# Altium project Luna v2.PrjPcb (part 5 of 7)

## Sheet 12 DMIC.SchDoc: Luna v2
size A2; VersionControl_RevNumber: DNP; IsUserConfigurable: DNP; OrgAddr3: Sunrise FL 33323; OrgName: Pixels on Target; Page Create Date: March  8, 1995; Page Number: 5; Page Size: A2; Page Count: 14; OrgAddr2: Suite #104; RevCode: A; Doc: SCH30-00070-00; DsnPath: C:\Users\Carter Nichols\Documents\BitBucket boards (Cadence)\30-00070-00_Original\SCH30-00070-00.DSN; SchematicName: SC30-00070-00; PageName: 05-POWER IN; PageSize: A2; TopSchematic: True; Address4: United States
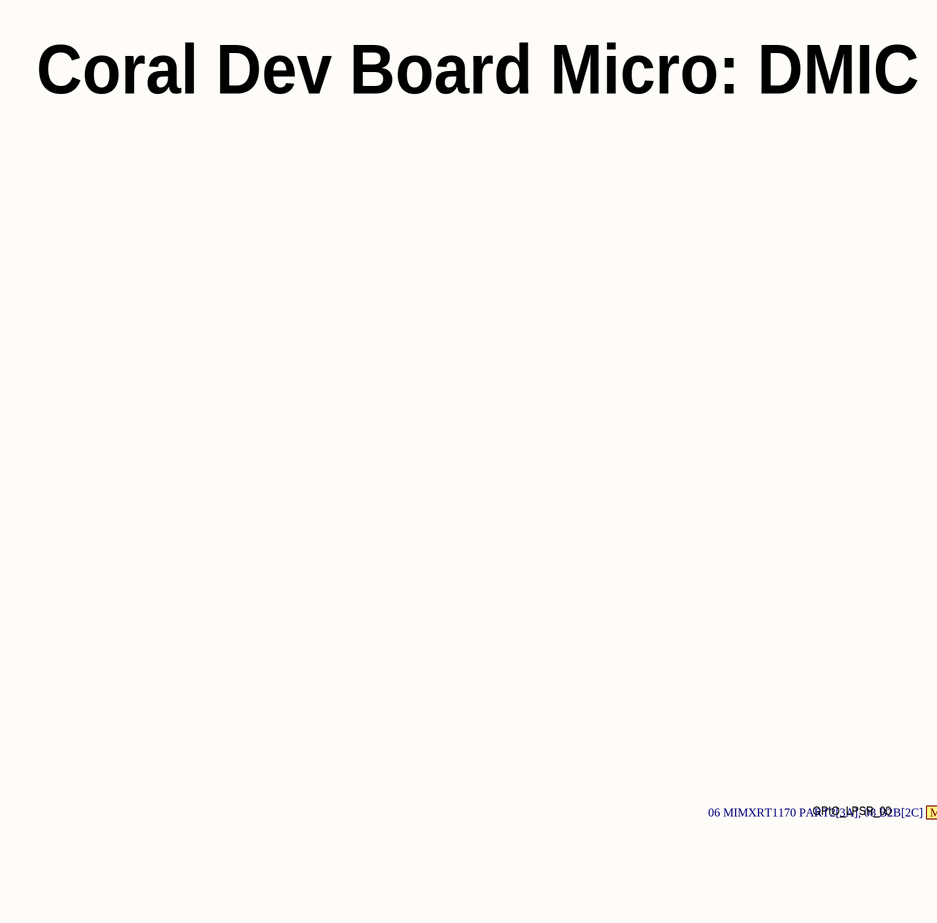
[diagram p17: 12 DMIC.SchDoc, left]
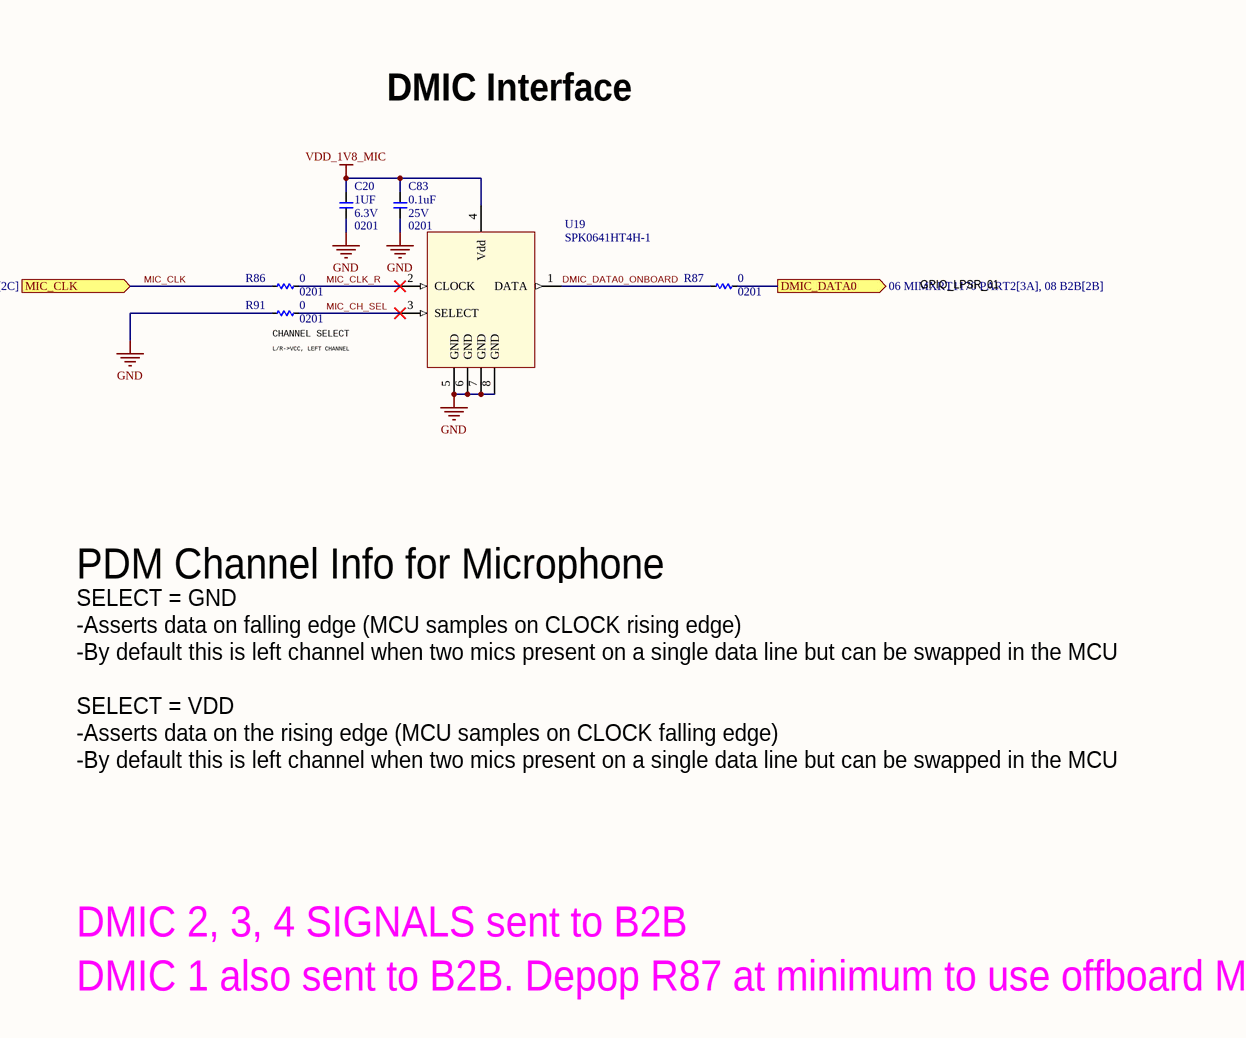
[diagram p18: 12 DMIC.SchDoc, right]

### Parts
C20  value 1UF  Package: 0201  Voltage: 6.3V  [C0201_H0.39MM]  (hidden comment: __Template_Cap)
C83  value 0.1uF  Package: 0201  Voltage: 25V  [C0201Y]  (hidden comment: __Template_Cap)
R86  value 0  Package: 0201  [R0201]
R87  value 0  Package: 0201  [R0201]
R91  value 0  Package: 0201  [R0201]
U19  MFG P/N: SPK0641HT4H-1  [MIC_SPK0641HT4H-1]  (hidden comment: MIC_SPK0641HT4H-1)

### Ports
DMIC_DATA0 (out, see 06 MIMXRT1170 PART2[3A], 08 B2B[2B]), MIC_CLK (in, see 06 MIMXRT1170 PART2[3A], 08 B2B[2C])

### Nets
GND: C20.2 C83.2 R91.1 U19.5(GND) U19.6(GND) U19.7(GND) U19.8(GND)
VDD_1V8_MIC: C20.1 C83.1 U19.4(Vdd)
DMIC_DATA0: R87.2 ; port DMIC_DATA0
DMIC_DATA0_ONBOARD: R87.1 U19.1(DATA)
MIC_CH_SEL: R91.2 U19.3(SELECT)
MIC_CLK: R86.1 ; port MIC_CLK
MIC_CLK_R: R86.2 U19.2(CLOCK)

### Notes on the sheet
- Coral Dev Board Micro: DMIC
- DMIC Interface
- GPIO_LPSR_00
- (near R91) CHANNEL SELECT
- GPIO_LPSR_01
- (near R91) L/R->VCC, LEFT CHANNEL
- PDM Channel Info for Microphone
- SELECT = GND
  -Asserts data on falling edge (MCU samples on CLOCK rising edge)
  -By default this is left channel when two mics present on a single data line but can be swapped in the MCU
  SELECT = VDD
  -Asserts data on the rising edge (MCU samples on CLOCK falling edge)
  -By default this is left channel when two mics present on a single data line but can be swapped in the MCU
- DMIC 2, 3, 4 SIGNALS sent to B2B
- DMIC 1 also sent to B2B. Depop R87 at minimum to use offboard MIC1 left channel.
- Title
- Size:
- Date:
- File:
- A2
- Number:
- Time:
- Revision:
- Sheet
- of

### Library data of the parts
C20 = 1771: CAP, CER, X6S, 1uF, 20%, 6.3V, 0201, 0.39mm; ID: 1771; MFG: MURATA; MFG P/N: GRM033C80J105ME05D; EPIC: G150-02531-00; Status: In Development; Dielectric: X6S; Tolerance: 20%; Height: 0.39mm; Supplier 1: Digi-Key; HelpURL: https://www.digikey.com/product-detail/en/murata-electronics-north-america/GRM033C80J105ME05D/490-13218-1-ND/5877426; ComponentLink1Description: Datasheet; ComponentLink1URL: https://psearch.en.murata.com/capacitor/product/GRM033C80J105ME05%23.pdf; Supplier Part Number 1: 490-13218-1-ND
C83 = 386: CAP, CER, X5R, 0.1uF, 25V, 20%, 0201, 0.33mm T; ID: 386; MFG: MURATA; MFG P/N: GRM033R61E104ME14D; XPN: 150-01204-00; Status: Released; Dielectric: X5R; Tolerance: 20%; Height: 0.33mm T; ComponentLink1Description: Datasheet; COMMON: 150-01204-00; LOON: 150-01204-00; Gecko: 150-01204-00
R86 R87 R91 = 8315: RES, 0.0, 1/20W, 0201; ID: 8315; MFG: PANASONIC; MFG P/N: ERJ1GN0R00C; Tolerance: JUMPER; COMMON: 470-00013-00; PROXY: Use ID #6940; Status: Released; Power: 1/20W; LOON: 470-00013-00; Gecko: 470-00013-00; XPN: 470-00013-00
U19 = 212: AUDIO, MIC, MEMS, OMNIDIRECTIONAL, DIGITAl/PDM O/P, 20Hz TO 20KHz, -26dB SENSITIVITY, +/-1dB, 64.5dB S/N R, SMD; ID: 212; MFG: Knowles; Voltage, Rated: 1.6 V ~ 3.6 V; Status: Released; Category: Microphones; RoHS Compliant: Yes; Supplier 1: Digi-Key; Height: 1.1mm; Mounting Type: SMD; HelpURL: https://www.digikey.com/en/products/detail/knowles/SPK0641HT4H-1/8573345; ComponentLink1Description: Datasheet; ComponentLink1URL: https://www.knowles.com/docs/default-source/model-downloads/spk0641ht4h-1-rev-a.pdf; Supplier Part Number 1: 423-1425-2-ND

## Sheet 13 USB.SchDoc: Luna v2
size A2; VersionControl_RevNumber: DNP; IsUserConfigurable: DNP; OrgAddr3: Sunrise FL 33323; OrgName: Pixels on Target; Page Create Date: March  8, 1995; Page Number: 5; Page Size: A2; Page Count: 14; OrgAddr2: Suite #104; RevCode: A; Doc: SCH30-00070-00; DsnPath: C:\Users\Carter Nichols\Documents\BitBucket boards (Cadence)\30-00070-00_Original\SCH30-00070-00.DSN; SchematicName: SC30-00070-00; PageName: 05-POWER IN; PageSize: A2; TopSchematic: True; Address4: United States
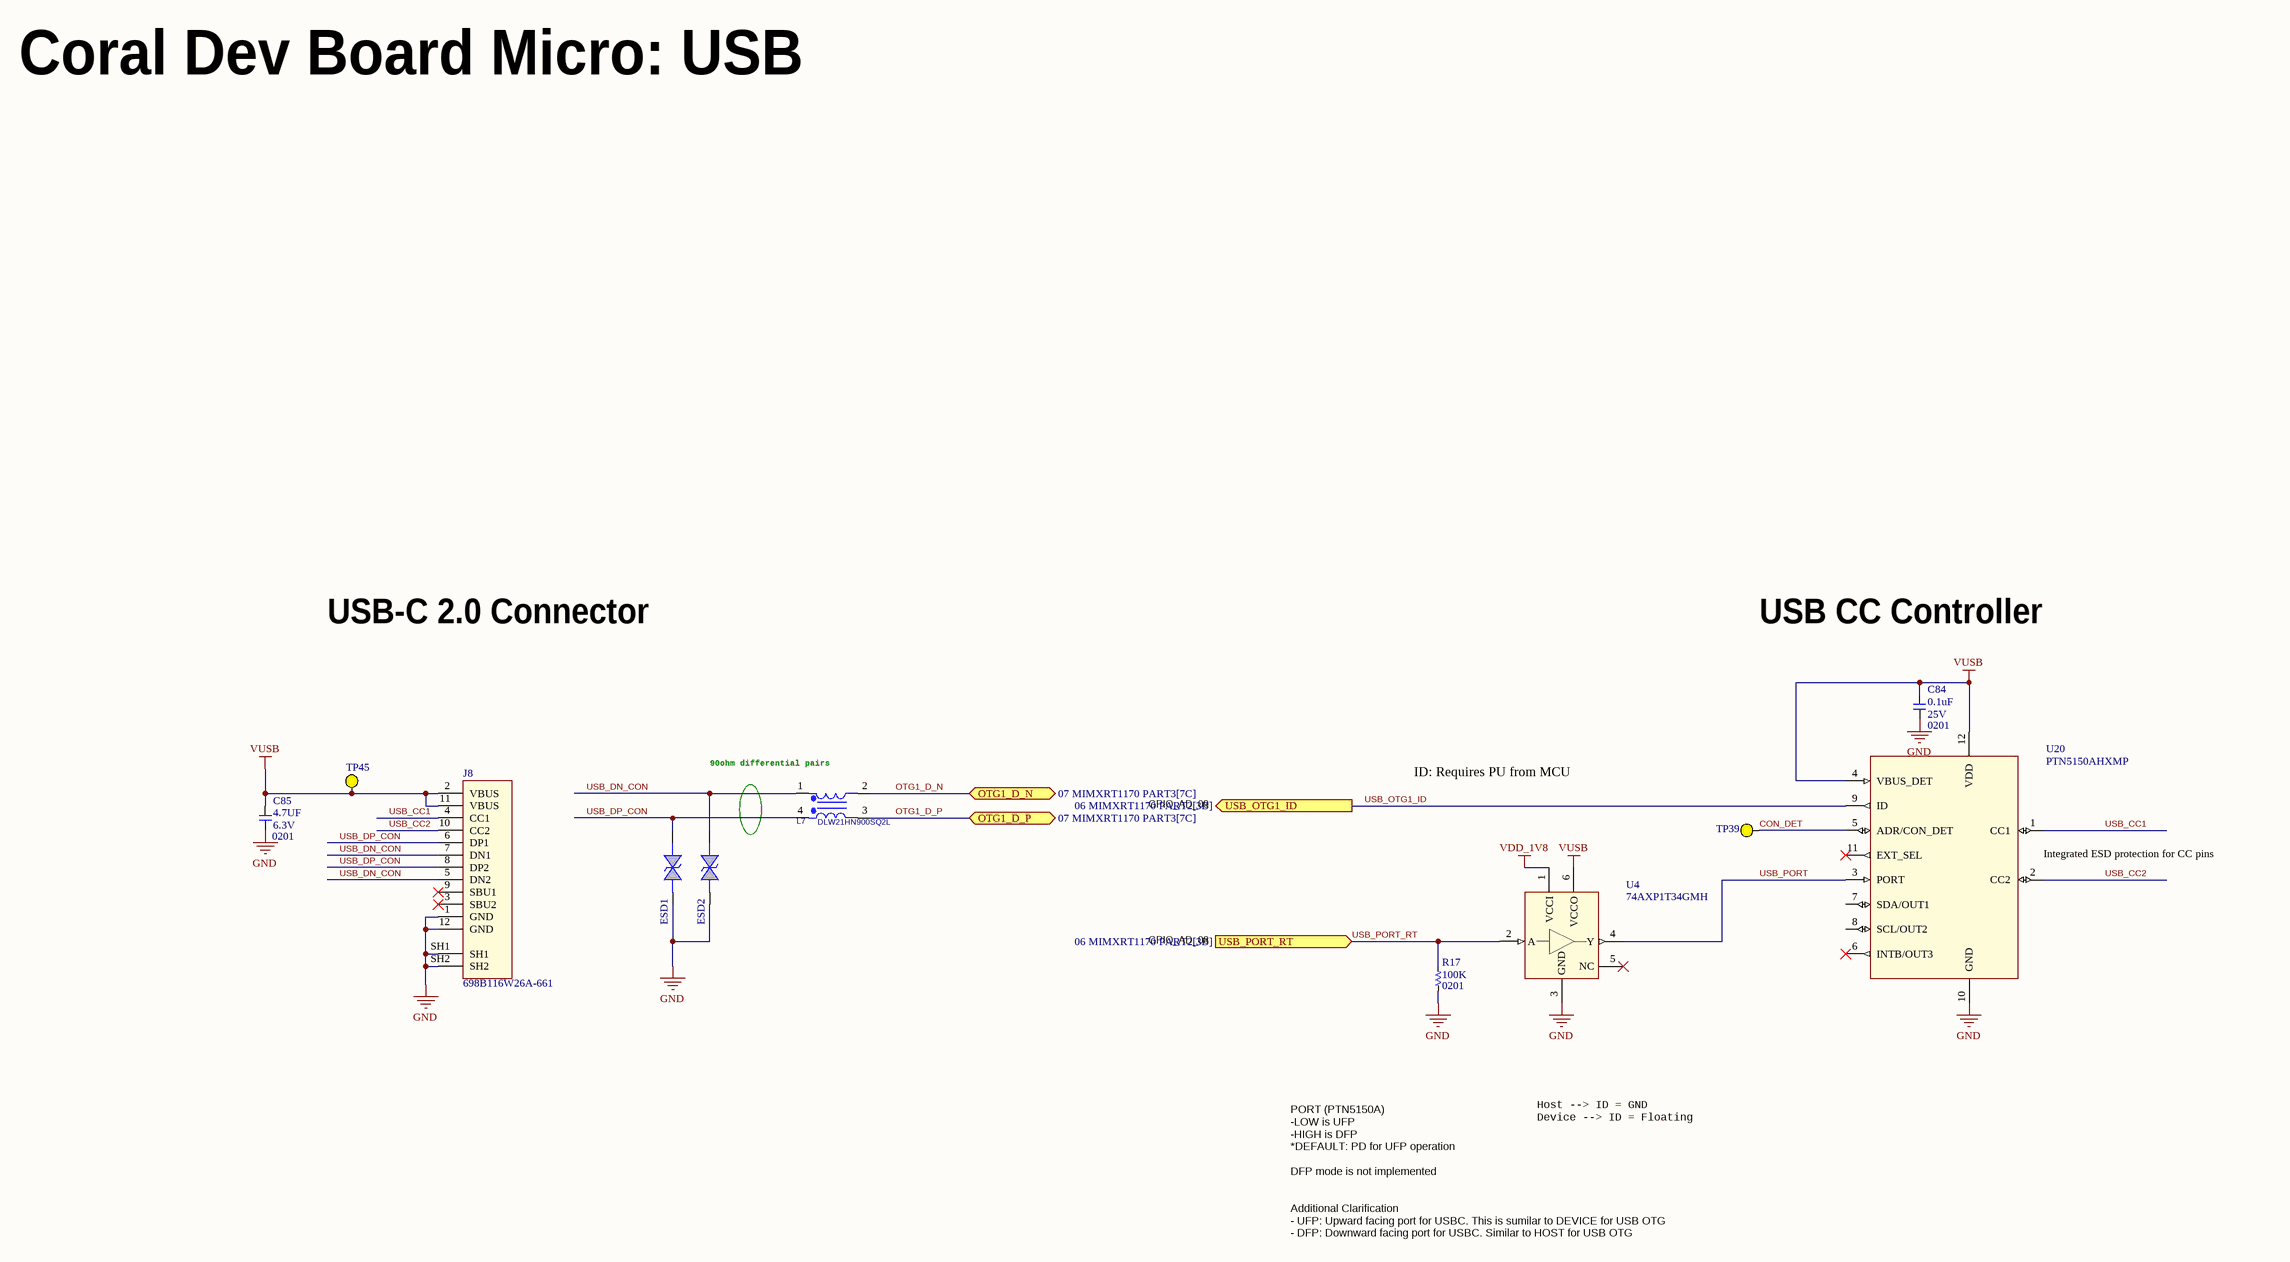
[diagram p19: 13 USB.SchDoc]

### Parts
C84  value 0.1uF  Package: 0201  Voltage: 25V  [C0201Y]  (hidden comment: __Template_Cap)
C85  value 4.7UF  Package: 0201  Voltage: 6.3V  [C0201Y]  (hidden comment: __Template_Cap)
ESD1  3.5pF/5V  [0201]  (value not drawn)
ESD2  3.5pF/5V  [0201]  (value not drawn)
J8  MFG P/N: 698B116W26A-661  [EDAC_698B116W26A-661]
L7  DLW21HN900SQ2L  [IND4_CHOKE_0805]
R17  value 100K  Package: 0201  [R0201]
TP39  TESTPAD_30MIL  [TESTPAD_SMT_30MIL]  (value not drawn)  (no BOM)
TP45  TESTPAD_30MIL  [TESTPAD_SMT_30MIL]  (value not drawn)  (no BOM)
U4  MFG P/N: 74AXP1T34GMH  [SON50P145X100X50-6]  (hidden comment: TRANSLATOR_74AXP1T34GMH)
U20  MFG P/N: PTN5150AHXMP  [X2QFN12_1.6X1.6MMM]  (hidden comment: CONTROLLER_PTN5150AHXMP)

### Ports
OTG1_D_N (bidir, see 07 MIMXRT1170 PART3[7C]), OTG1_D_P (bidir, see 07 MIMXRT1170 PART3[7C]), USB_OTG1_ID (out, see 06 MIMXRT1170 PART2[3B]), USB_PORT_RT (in, see 06 MIMXRT1170 PART2[3B])

### Nets
GND: C84.2 C85.2 ESD1.1 ESD2.1 J8.1(GND) J8.12(GND) J8.SH1 J8.SH2 R17.1 U4.3(GND) U20.10(GND)
VDD_1V8: U4.1(VCCI)
VUSB: C84.1 C85.1 J8.2(VBUS) J8.11(VBUS) TP45.1 U4.6(VCCO) U20.4(VBUS_DET) U20.12(VDD)
CON_DET: TP39.1 U20.5(ADR/CON_DET)
OTG1_D_N: L7.2 ; port OTG1_D_N
OTG1_D_P: L7.3 ; port OTG1_D_P
USB_CC1: J8.4(CC1) U20.1(CC1)
USB_CC2: J8.10(CC2) U20.2(CC2)
USB_DN_CON: ESD2.2 J8.5(DN2) J8.7(DN1) L7.1
USB_DP_CON: ESD1.2 J8.6(DP1) J8.8(DP2) L7.4
USB_OTG1_ID: U20.9(ID) ; port USB_OTG1_ID
USB_PORT: U4.4(Y) U20.3(PORT)
USB_PORT_RT: R17.2 U4.2(A) ; port USB_PORT_RT

Not connected (* = marked no-connect by the designer): J8 3(SBU2)* 9(SBU1)*; U4 5(NC)*; U20 6(INTB/OUT3)* 7(SDA/OUT1) 8(SCL/OUT2) 11(EXT_SEL)*

### Notes on the sheet
- Coral Dev Board Micro: USB
- USB-C 2.0 Connector
- USB CC Controller
- (near L7) 90ohm differential pairs
- ID: Requires PU from MCU
- GPIO_AD_09
- (near U20) Integrated ESD protection for CC pins
- GPIO_AD_08
- Host --> ID = GND
  Device --> ID = Floating
- PORT (PTN5150A)
  -LOW is UFP
  -HIGH is DFP
  *DEFAULT: PD for UFP operation
  DFP mode is not implemented
- Additional Clarification
  - UFP: Upward facing port for USBC. This is sumilar to DEVICE for USB OTG
  - DFP: Downward facing port for USBC. Similar to HOST for USB OTG
- Title
- Size:
- Date:
- File:
- A2
- Number:
- Time:
- Revision:
- Sheet
- of

### Library data of the parts
C84 = 386: as C83 on sheet 12 DMIC; Status: Released; Dielectric: X5R; Tolerance: 20%; Height: 0.33mm T; ComponentLink1Description: Datasheet; COMMON: 150-01204-00; LOON: 150-01204-00; Gecko: 150-01204-00
C85 = 1199: CAP, CER, X5R, 4.7uF, 20%, 6.3V, 0201; ID: 1199; MFG: MURATA; MFG P/N: GRM035R60J475ME15D; XPN: 150-01224-00; PROXY: 150-03477-00; Status: Released; Dielectric: X5R; Tolerance: 20%; Height: 0.33mm T; ComponentLink1Description: Datasheet; COMMON: 150-01224-00; LOON: 150-01224-00; Gecko: 150-01224-00
ESD1 ESD2 = DIODE BI-DIR TRIG: DIODE TVS 15kV 10V 50A 8pF SMT RoHS; MPN: DESD5V0V1BCSP-7; QPN: BC5V0V1BZ02; QPN Description: DIODE ESD SMD DESD5V0V1BCSP-7 6V,DSN0603; Function Code: USB; QCI MPN: DESD5V0V1BCSP-7; QCI Supplier: DDS
J8 = 1283: CONN, USB-C, RCPT, RA, USB 2.0, 16 P, 0.5MM PITCH, GOLD, SMT; ID: 1283; MFG: EDAC Inc; Number of Positions: 12; Current Rating: 3A; Voltage, Rated: 100VAC; Sub Assy Qty 2: 0; Status: Released; RoHS Compliant: Yes; Mounting Type: Surface Mount; Orientation: Right Angle; Number of Rows: 1; Operating Temperature: -30°C ~ 85°C; ComponentLink1Description: Datasheet; ComponentLink1URL: https://drive.google.com/corp/drive/folders/1cT-VNuTRhR0OJylJtjEkdbP9sP_ssI5q; Height: 2.71mm; Sub Assy Qty 3: 0; Sub Assy Qty 4: 0
L7 = IND_CMC_DLW21: IND CHK 90 OHM@100MHZ 330MA 25% 0805; QPN: CX1HN900000; QPN Description: EMI FILTER DLW21HN900SQ2L(90,330MA); Function Code: DBG; Supplier 1: Digi-Key; Supplier Part Number 1: 490-1064-1-ND; MPN: DLW21HN900SQ2L; QCI MPN: DLW21HN900SQ2L; QCI Supplier: MUR
R17 = 7818: RES, 100K, 1%, 1/20W, 0201; ID: 7818; MFG: PANASONIC; MFG P/N: ERJ1GEF1003C; COMMON: 470-00506-00; Status: NRND; Power: 1/20W; Tolerance: 1%; LOON: 470-00506-00; Gecko: 470-00506-00; XPN: 470-00506-00
TP39 TP45 = 178: TESTPAD_SMT_30MIL; ID: 178; MFG: _PCB Feature; Status: Released; ComponentLink1URL: _PCB Feature
U4 = 441: IC, TRANSLATOR, 74AXP1, UNIDIR, 1-CH, NON-INVERTED O/P, LOW NOISE OVERSHOOT, XSON-6; ID: 441; MFG: Nexperia USA Inc.; Status: Released; Package: 6-XSON, SOT886 (1.45x1); Category: Integrated Circuits (ICs); RoHS Compliant: Yes; Supplier 1: Digi-Key; ComponentLink1Description: Datasheet; ComponentLink1URL: https://assets.nexperia.com/documents/data-sheet/74AXP1T34.pdf; Mounting Type: SMD; Height: 0.5mm; Supplier Part Number 1: 1727-2482-2-ND; HelpURL: https://www.digikey.com/en/products/detail/nexperia-usa-inc/74AXP1T34GMH/5971133?s=N4IgTCBcDaIOwBYCCANACgRgCoGYEHEBZACRAF0BfIA
U20 = 224: IC, HOST CTLR, PTN5150A, USB, 2.7 TO 5.5 VIN, X2QFN-12; ID: 224; MFG: NXP USA Inc.; Status: Released; Package: 12-X2QFN (1.6x1.6); RoHS Compliant: YES; Supplier 1: Digi-Key; HelpURL: https://www.digikey.in/product-detail/en/nxp-usa-inc/PTN5150AHXMP/568-13083-1-ND/6569882; ComponentLink1Description: Datasheet; ComponentLink1URL: https://www.nxp.com/docs/en/data-sheet/PTN5150A.pdf; Mounting Type: SMD; Supplier Part Number 1: 568-13083-1-ND

## Sheet 14 TPU.SchDoc: Luna v2
size A2; VersionControl_RevNumber: DNP; IsUserConfigurable: DNP; OrgAddr3: Sunrise FL 33323; OrgName: Pixels on Target; Page Create Date: March  8, 1995; Page Number: 5; Page Size: A2; Page Count: 14; OrgAddr2: Suite #104; RevCode: A; Doc: SCH30-00070-00; DsnPath: C:\Users\Carter Nichols\Documents\BitBucket boards (Cadence)\30-00070-00_Original\SCH30-00070-00.DSN; SchematicName: SC30-00070-00; PageName: 05-POWER IN; PageSize: A2; TopSchematic: True; Address4: United States
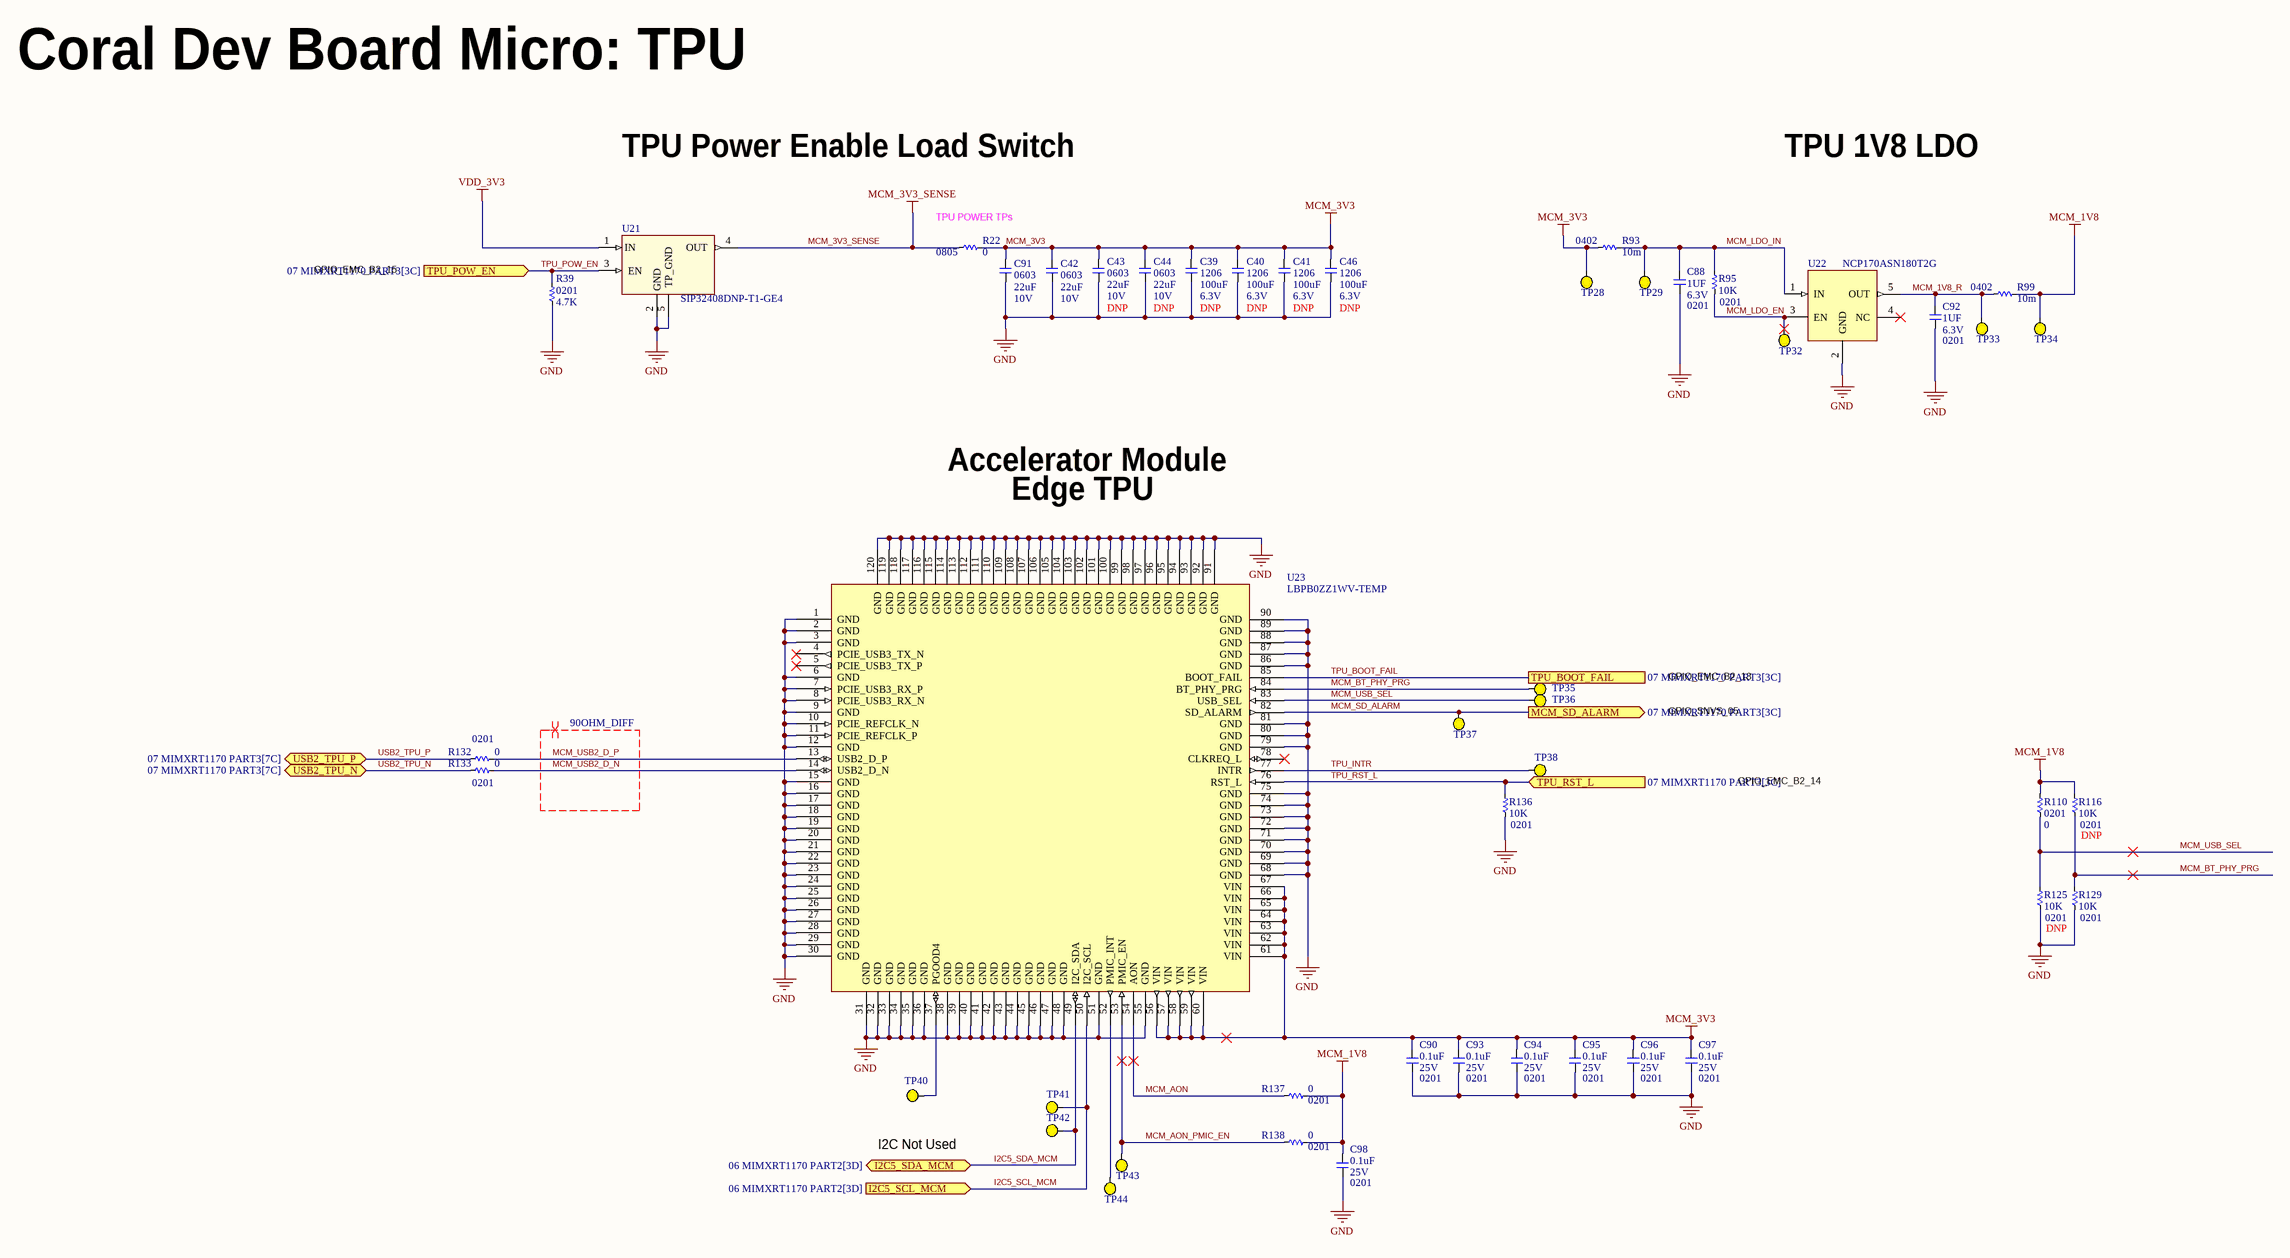
[diagram p20: 14 TPU.SchDoc]

### Parts
C39  value 100uF  Package: 1206  Voltage: 6.3V  [C1206Y_1.90MM]  (hidden comment: __Template_Cap)
C40  value 100uF  Package: 1206  Voltage: 6.3V  [C1206Y_1.90MM]  (hidden comment: __Template_Cap)
C41  value 100uF  Package: 1206  Voltage: 6.3V  [C1206Y_1.90MM]  (hidden comment: __Template_Cap)
C42  value 22uF  Package: 0603  Voltage: 10V  [C0603]  (hidden comment: __Template_Cap)
C43  value 22uF  Package: 0603  Voltage: 10V  [C0603]  (hidden comment: __Template_Cap)
C44  value 22uF  Package: 0603  Voltage: 10V  [C0603]  (hidden comment: __Template_Cap)
C46  value 100uF  Package: 1206  Voltage: 6.3V  [C1206Y_1.90MM]  (hidden comment: __Template_Cap)
C88  value 1UF  Package: 0201  Voltage: 6.3V  [C0201_H0.39MM]  (hidden comment: __Template_Cap)
C90  value 0.1uF  Package: 0201  Voltage: 25V  [C0201Y]  (hidden comment: __Template_Cap)
C91  value 22uF  Package: 0603  Voltage: 10V  [C0603]  (hidden comment: __Template_Cap)
C92  value 1UF  Package: 0201  Voltage: 6.3V  [C0201_H0.39MM]  (hidden comment: __Template_Cap)
C93  value 0.1uF  Package: 0201  Voltage: 25V  [C0201Y]  (hidden comment: __Template_Cap)
C94  value 0.1uF  Package: 0201  Voltage: 25V  [C0201Y]  (hidden comment: __Template_Cap)
C95  value 0.1uF  Package: 0201  Voltage: 25V  [C0201Y]  (hidden comment: __Template_Cap)
C96  value 0.1uF  Package: 0201  Voltage: 25V  [C0201Y]  (hidden comment: __Template_Cap)
C97  value 0.1uF  Package: 0201  Voltage: 25V  [C0201Y]  (hidden comment: __Template_Cap)
C98  value 0.1uF  Package: 0201  Voltage: 25V  [C0201Y]  (hidden comment: __Template_Cap)
R22  value 0  Package: 0805  [R0805]
R39  value 4.7K  Package: 0201  [R0201]
R93  value 10m  Package: 0402  [R0402]
R95  value 10K  Package: 0201  [R0201]
R99  value 10m  Package: 0402  [R0402]
R110  value 0  Package: 0201  [R0201]
R116  value 10K  Package: 0201  [R0201]
R125  value 10K  Package: 0201  [R0201]
R129  value 10K  Package: 0201  [R0201]
R132  value 0  Package: 0201  [R0201]
R133  value 0  Package: 0201  [R0201]
R136  value 10K  Package: 0201  [R0201]
R137  value 0  Package: 0201  [R0201]
R138  value 0  Package: 0201  [R0201]
TP28  TESTPAD_25MIL  [TESTPAD_SMT_25MIL]  (value not drawn)  (no BOM)
TP29  TESTPAD_25MIL  [TESTPAD_SMT_25MIL]  (value not drawn)  (no BOM)
TP32  TESTPAD_25MIL  [TESTPAD_SMT_25MIL]  (value not drawn)  (no BOM)
TP33  TESTPAD_25MIL  [TESTPAD_SMT_25MIL]  (value not drawn)  (no BOM)
TP34  TESTPAD_25MIL  [TESTPAD_SMT_25MIL]  (value not drawn)  (no BOM)
TP35  TESTPAD_25MIL  [TESTPAD_SMT_25MIL]  (value not drawn)  (no BOM)
TP36  TESTPAD_25MIL  [TESTPAD_SMT_25MIL]  (value not drawn)  (no BOM)
TP37  TESTPAD_25MIL  [TESTPAD_SMT_25MIL]  (value not drawn)  (no BOM)
TP38  TESTPAD_25MIL  [TESTPAD_SMT_25MIL]  (value not drawn)  (no BOM)
TP40  TESTPAD_25MIL  [TESTPAD_SMT_25MIL]  (value not drawn)  (no BOM)
TP41  TESTPAD_25MIL  [TESTPAD_SMT_25MIL]  (value not drawn)  (no BOM)
TP42  TESTPAD_25MIL  [TESTPAD_SMT_25MIL]  (value not drawn)  (no BOM)
TP43  TESTPAD_25MIL  [TESTPAD_SMT_25MIL]  (value not drawn)  (no BOM)
TP44  TESTPAD_25MIL  [TESTPAD_SMT_25MIL]  (value not drawn)  (no BOM)
U21  MFG P/N: SIP32408DNP-T1-GE4  [TDFN120X160X60-4-TP]  (hidden comment: SWITCH_SIP32408DNP-T1-GE4)
U22  MFG P/N: NCP170ASN180T2G  [TSOP95P275X110-5]  (hidden comment: LDO_NCP170ASN180T2G)
U23  LBPB0ZZ1WV-TEMP  [QFN120_0P5_10X15]

### Ports
I2C5_SCL_MCM (in, see 06 MIMXRT1170 PART2[3D]), I2C5_SDA_MCM (bidir, see 06 MIMXRT1170 PART2[3D]), MCM_SD_ALARM (out, see 07 MIMXRT1170 PART3[3C]), TPU_BOOT_FAIL (see 07 MIMXRT1170 PART3[3C]), TPU_POW_EN (in, see 07 MIMXRT1170 PART3[3C]), TPU_RST_L (in, see 07 MIMXRT1170 PART3[3C]), USB2_TPU_N (bidir, see 07 MIMXRT1170 PART3[7C]), USB2_TPU_P (bidir, see 07 MIMXRT1170 PART3[7C])

### Nets
GND: C39.2 C40.2 C41.2 C42.2 C43.2 C44.2 C46.2 C88.2 C90.2 C91.2 C92.2 C93.2 C94.2 C95.2 C96.2 C97.2 C98.2 R39.1 R125.1 R129.1 R136.1 U21.2(GND) U21.5(TP_GND) U22.2(GND) U23.1(GND) U23.2(GND) U23.3(GND) U23.6(GND) U23.7(PCIE_USB3_RX_P) U23.8(PCIE_USB3_RX_N) U23.9(GND) U23.10(PCIE_REFCLK_N) U23.11(PCIE_REFCLK_P) U23.12(GND) U23.15(GND) U23.16(GND) U23.17(GND) U23.18(GND) U23.19(GND) U23.20(GND) U23.21(GND) U23.22(GND) U23.23(GND) U23.24(GND) U23.25(GND) U23.26(GND) U23.27(GND) U23.28(GND) U23.29(GND) U23.30(GND) U23.31(GND) U23.32(GND) U23.33(GND) U23.34(GND) U23.35(GND) U23.36(GND) U23.38(GND) U23.39(GND) U23.40(GND) U23.41(GND) U23.42(GND) U23.43(GND) U23.44(GND) U23.45(GND) U23.46(GND) U23.47(GND) U23.48(GND) U23.51(GND) U23.55(GND) U23.68(GND) U23.69(GND) U23.70(GND) U23.71(GND) U23.72(GND) U23.73(GND) U23.74(GND) U23.75(GND) U23.79(GND) U23.80(GND) U23.81(GND) U23.86(GND) U23.87(GND) U23.88(GND) U23.89(GND) U23.90(GND) U23.91(GND) U23.92(GND) U23.93(GND) U23.94(GND) U23.95(GND) U23.96(GND) U23.97(GND) U23.98(GND) U23.99(GND) U23.100(GND) U23.101(GND) U23.102(GND) U23.103(GND) U23.104(GND) U23.105(GND) U23.106(GND) U23.107(GND) U23.108(GND) U23.109(GND) U23.110(GND) U23.111(GND) U23.112(GND) U23.113(GND) U23.114(GND) U23.115(GND) U23.116(GND) U23.117(GND) U23.118(GND) U23.119(GND) U23.120(GND)
MCM_1V8: C98.1 R99.2 R110.2 R116.2 R137.2 R138.2 TP34.1
MCM_3V3: C39.1 C40.1 C41.1 C42.1 C43.1 C44.1 C46.1 C90.1 C91.1 C93.1 C94.1 C95.1 C96.1 C97.1 R22.2 R93.1 TP28.1 U23.56(VIN) U23.57(VIN) U23.58(VIN) U23.59(VIN) U23.60(VIN) U23.61(VIN) U23.62(VIN) U23.63(VIN) U23.64(VIN) U23.65(VIN) U23.66(VIN) U23.67(VIN)
MCM_3V3_SENSE: R22.1 U21.4(OUT)
VDD_3V3: U21.1(IN)
I2C5_SCL_MCM: TP41.1 U23.50(I2C_SCL) ; port I2C5_SCL_MCM
I2C5_SDA_MCM: TP42.1 U23.49(I2C_SDA) ; port I2C5_SDA_MCM
MCM_1V8_R: C92.1 R99.1 TP33.1 U22.5(OUT)
MCM_AON: R137.1 U23.54(AON)
MCM_AON_PMIC_EN: R138.1 TP43.1 U23.53(PMIC_EN)
MCM_BT_PHY_PRG: R116.1 R129.2 TP35.1 U23.84(BT_PHY_PRG)
MCM_LDO_EN: R95.1 TP32.1 U22.3(EN)
MCM_LDO_IN: C88.1 R93.2 R95.2 TP29.1 U22.1(IN)
MCM_SD_ALARM: TP37.1 U23.82(SD_ALARM) ; port MCM_SD_ALARM
MCM_USB2_D_N: R133.2 U23.14(USB2_D_N)
MCM_USB2_D_P: R132.2 U23.13(USB2_D_P)
MCM_USB_SEL: R110.1 R125.2 TP36.1 U23.83(USB_SEL)
TPU_BOOT_FAIL: U23.85(BOOT_FAIL) ; port TPU_BOOT_FAIL
TPU_INTR: TP38.1 U23.77(INTR)
TPU_POW_EN: R39.2 U21.3(EN) ; port TPU_POW_EN
TPU_RST_L: R136.2 U23.76(RST_L) ; port TPU_RST_L
USB2_TPU_N: R133.1 ; port USB2_TPU_N
USB2_TPU_P: R132.1 ; port USB2_TPU_P
NetTP40_1: TP40.1 U23.37(PGOOD4)
NetTP44_1: TP44.1 U23.52(PMIC_INT)

Not connected (* = marked no-connect by the designer): U22 4(NC)*; U23 4(PCIE_USB3_TX_N)* 5(PCIE_USB3_TX_P)* 78(CLKREQ_L)*

### Layout directives
differential pair; differential pair class 90OHM_DIFF: MCM_USB2_D_N, MCM_USB2_D_P

### Notes on the sheet
- Coral Dev Board Micro: TPU
- TPU Power Enable Load Switch
- TPU 1V8 LDO
- GPIO_EMC_B2_15
- (near R22) TPU POWER TPs
- Accelerator Module
- Edge TPU
- GPIO_EMC_B2_13
- GPIO_SNVS_05
- GPIO_EMC_B2_14
- (near TP40) I2C Not Used
- Title
- Size:
- Date:
- File:
- A2
- Number:
- Time:
- Revision:
- Sheet
- of

### Library data of the parts
C39-C41 C46 = 1051: CAP, CER, X5R, 100UF, 6.3V, 20%, 1206; ID: 1051; MFG: MURATA; MFG P/N: GRM31CR60J107ME39L; XPN: 150-00520-00; PROXY: 150-04679-00; Status: Obsolete; Dielectric: X5R; Tolerance: 20%; Height: 1.9mm T; ComponentLink1Description: Datasheet; COMMON: 150-00520-00; DNP: DNP
C42 C91 = 108: CAP, CER, X5R, 22uF, 20%, 10V, 0603; ID: 108; MFG: TDK; MFG P/N: C1608X5R1A226M080AC; XPN: 150-00202-00; PROXY: Use ID #452; Status: Released; Dielectric: X5R; Tolerance: 20%; Height: 1mm; ComponentLink1Description: Datasheet; COMMON: 150-00202-00
C43 C44 = 392: CAP, CER, X5R, 22uF, 20%, 10V, 0603; ID: 392; MFG: SAMSUNG; MFG P/N: CL10A226MP8NUNE; XPN: 150-00202-00; PROXY: Use ID #452; Status: Released; Dielectric: X5R; Tolerance: 20%; Height: 0.9mm T; ComponentLink1Description: Datasheet; COMMON: 150-00202-00; DNP: DNP
C88 C92 = 1771: as C20 on sheet 12 DMIC; Status: In Development; Dielectric: X6S; Tolerance: 20%; Height: 0.39mm; Supplier 1: Digi-Key; HelpURL: https://www.digikey.com/product-detail/en/murata-electronics-north-america/GRM033C80J105ME05D/490-13218-1-ND/5877426; ComponentLink1Description: Datasheet; ComponentLink1URL: https://psearch.en.murata.com/capacitor/product/GRM033C80J105ME05%23.pdf; Supplier Part Number 1: 490-13218-1-ND
C90 C93-C98 = 386: as C83 on sheet 12 DMIC; Status: Released; Dielectric: X5R; Tolerance: 20%; Height: 0.33mm T; ComponentLink1Description: Datasheet; COMMON: 150-01204-00; LOON: 150-01204-00; Gecko: 150-01204-00
R22 = 7564: RES, 0, JUMPER, 1/8W, 0805; ID: 7564; MFG: YAGEO; MFG P/N: RC0805JR-070RL; Tolerance: 5%; COMMON: 470-00435-00; Gecko: 470-17928-00; Status: Released; Power: 1/8W; LOON: 470-00435-00; XPN: 470-00435-00
R39 = 6602: RES, 4.7K, 5%, 1/20W, 0201; ID: 6602; MFG: YAGEO; MFG P/N: RC0201JR-074K7L; COMMON: 470-00012-00; Status: Released; Power: 1/20W; Tolerance: 5%; LOON: 470-00012-00; Gecko: 470-00012-00; XPN: 470-00012-00
R93 R99 = 7159: RES, 0.01, 5%, 1/4W, 0402; ID: 7159; MFG: YAGEO; MFG P/N: PE0402JRF470R01L; COMMON: 470-02385-00; Status: Released; Power: 1/4W; Tolerance: 5%; LOON: 470-02385-00; Gecko: 470-02385-00; XPN: 470-02385-00
R95 R116 R125 R129 R136 = 4151: RES, 10K, 1%, 1/20W, 0201; ID: 4151; MFG: YAGEO; MFG P/N: RC0201FR-0710KL; COMMON: 470-00033-00; PROXY: 470-16076-00; Status: Released; Power: 1/20W; Tolerance: 1%; Height: 0.26mm; Supplier 1: Digi-Key; LOON: 470-00033-00; Gecko: 470-00033-00; XPN: 470-00033-00; Supplier Part Number 1: 311-10.0KMCT-ND
  R116 R125: DNP: DNP
R110 R132 R133 R137 R138 = 8315: as R86 on sheet 12 DMIC; Status: Released; Power: 1/20W; LOON: 470-00013-00; Gecko: 470-00013-00; XPN: 470-00013-00
TP28 TP29 TP32-TP38 TP40-TP44 = 115: TESTPAD_SMT_25MIL; ID: 115; MFG: _PCB Feature; Status: In Development; ComponentLink1URL: _PCB Feature
U21 = 926: IC, SW, SIP32408, HIGH-SIDE, N-CH, 1:1, 1.1V TO 5.5V VCL, 3.5A, 44mOHM RDS(ON), TDFN-4; ID: 926; MFG: Vishay Siliconix; Status: Released; Package: 4-TDFN (1.2x1.6); Category: Integrated Circuits (ICs); RoHS Compliant: Yes; Supplier 1: Digi-Key; HelpURL: https://www.digikey.com/en/products/detail/vishay-siliconix/SIP32408DNP-T1-GE4/4496331?s=N4IgTCBcDaIAQGUCSAFAzGALABgBwBEA5FAWgBUBGEgcQFFMQBdAXyA; ComponentLink1Description: Datasheet; ComponentLink1URL: https://www.vishay.com/docs/63717/sip32408.pdf; Mounting Type: SMD; Height: 0.6mm; Supplier Part Number 1: SIP32408DNP-T1-GE4TR-ND
U22 = 930: IC, REG, NCP170AS, LINEAR, FIXED, 2.2V TO 5.5V VIN, 1.8V VOUT, 150mA, TSOP-5; ID: 930; MFG: onsemi; Status: Released; Package: 5-TSOP; Category: Integrated Circuits (ICs); RoHS Compliant: Yes; Supplier 1: Digi-Key; HelpURL: https://www.digikey.com/en/products/detail/onsemi/NCP170ASN180T2G/9829222?s=N4IgTCBcDaIHIGEAKBGA7ABgIIGU4oA4MAVMAcRAF0BfIA; ComponentLink1Description: Datasheet; ComponentLink1URL: https://www.onsemi.com/pdf/datasheet/ncp170-d.pdf; Mounting Type: SMD; Height: 1.1mm; Supplier Part Number 1: NCP170ASN180T2GOSTR-ND
U23 = LBPB0ZZ1WV-TEMP: TPU module

## Sheet 15 BOOT.SchDoc: Luna v2
size A2; VersionControl_RevNumber: DNP; IsUserConfigurable: DNP; OrgAddr3: Sunrise FL 33323; OrgName: Pixels on Target; Page Create Date: March  8, 1995; Page Number: 5; Page Size: A2; Page Count: 14; OrgAddr2: Suite #104; RevCode: A; Doc: SCH30-00070-00; DsnPath: C:\Users\Carter Nichols\Documents\BitBucket boards (Cadence)\30-00070-00_Original\SCH30-00070-00.DSN; SchematicName: SC30-00070-00; PageName: 05-POWER IN; PageSize: A2; TopSchematic: True; Address4: United States
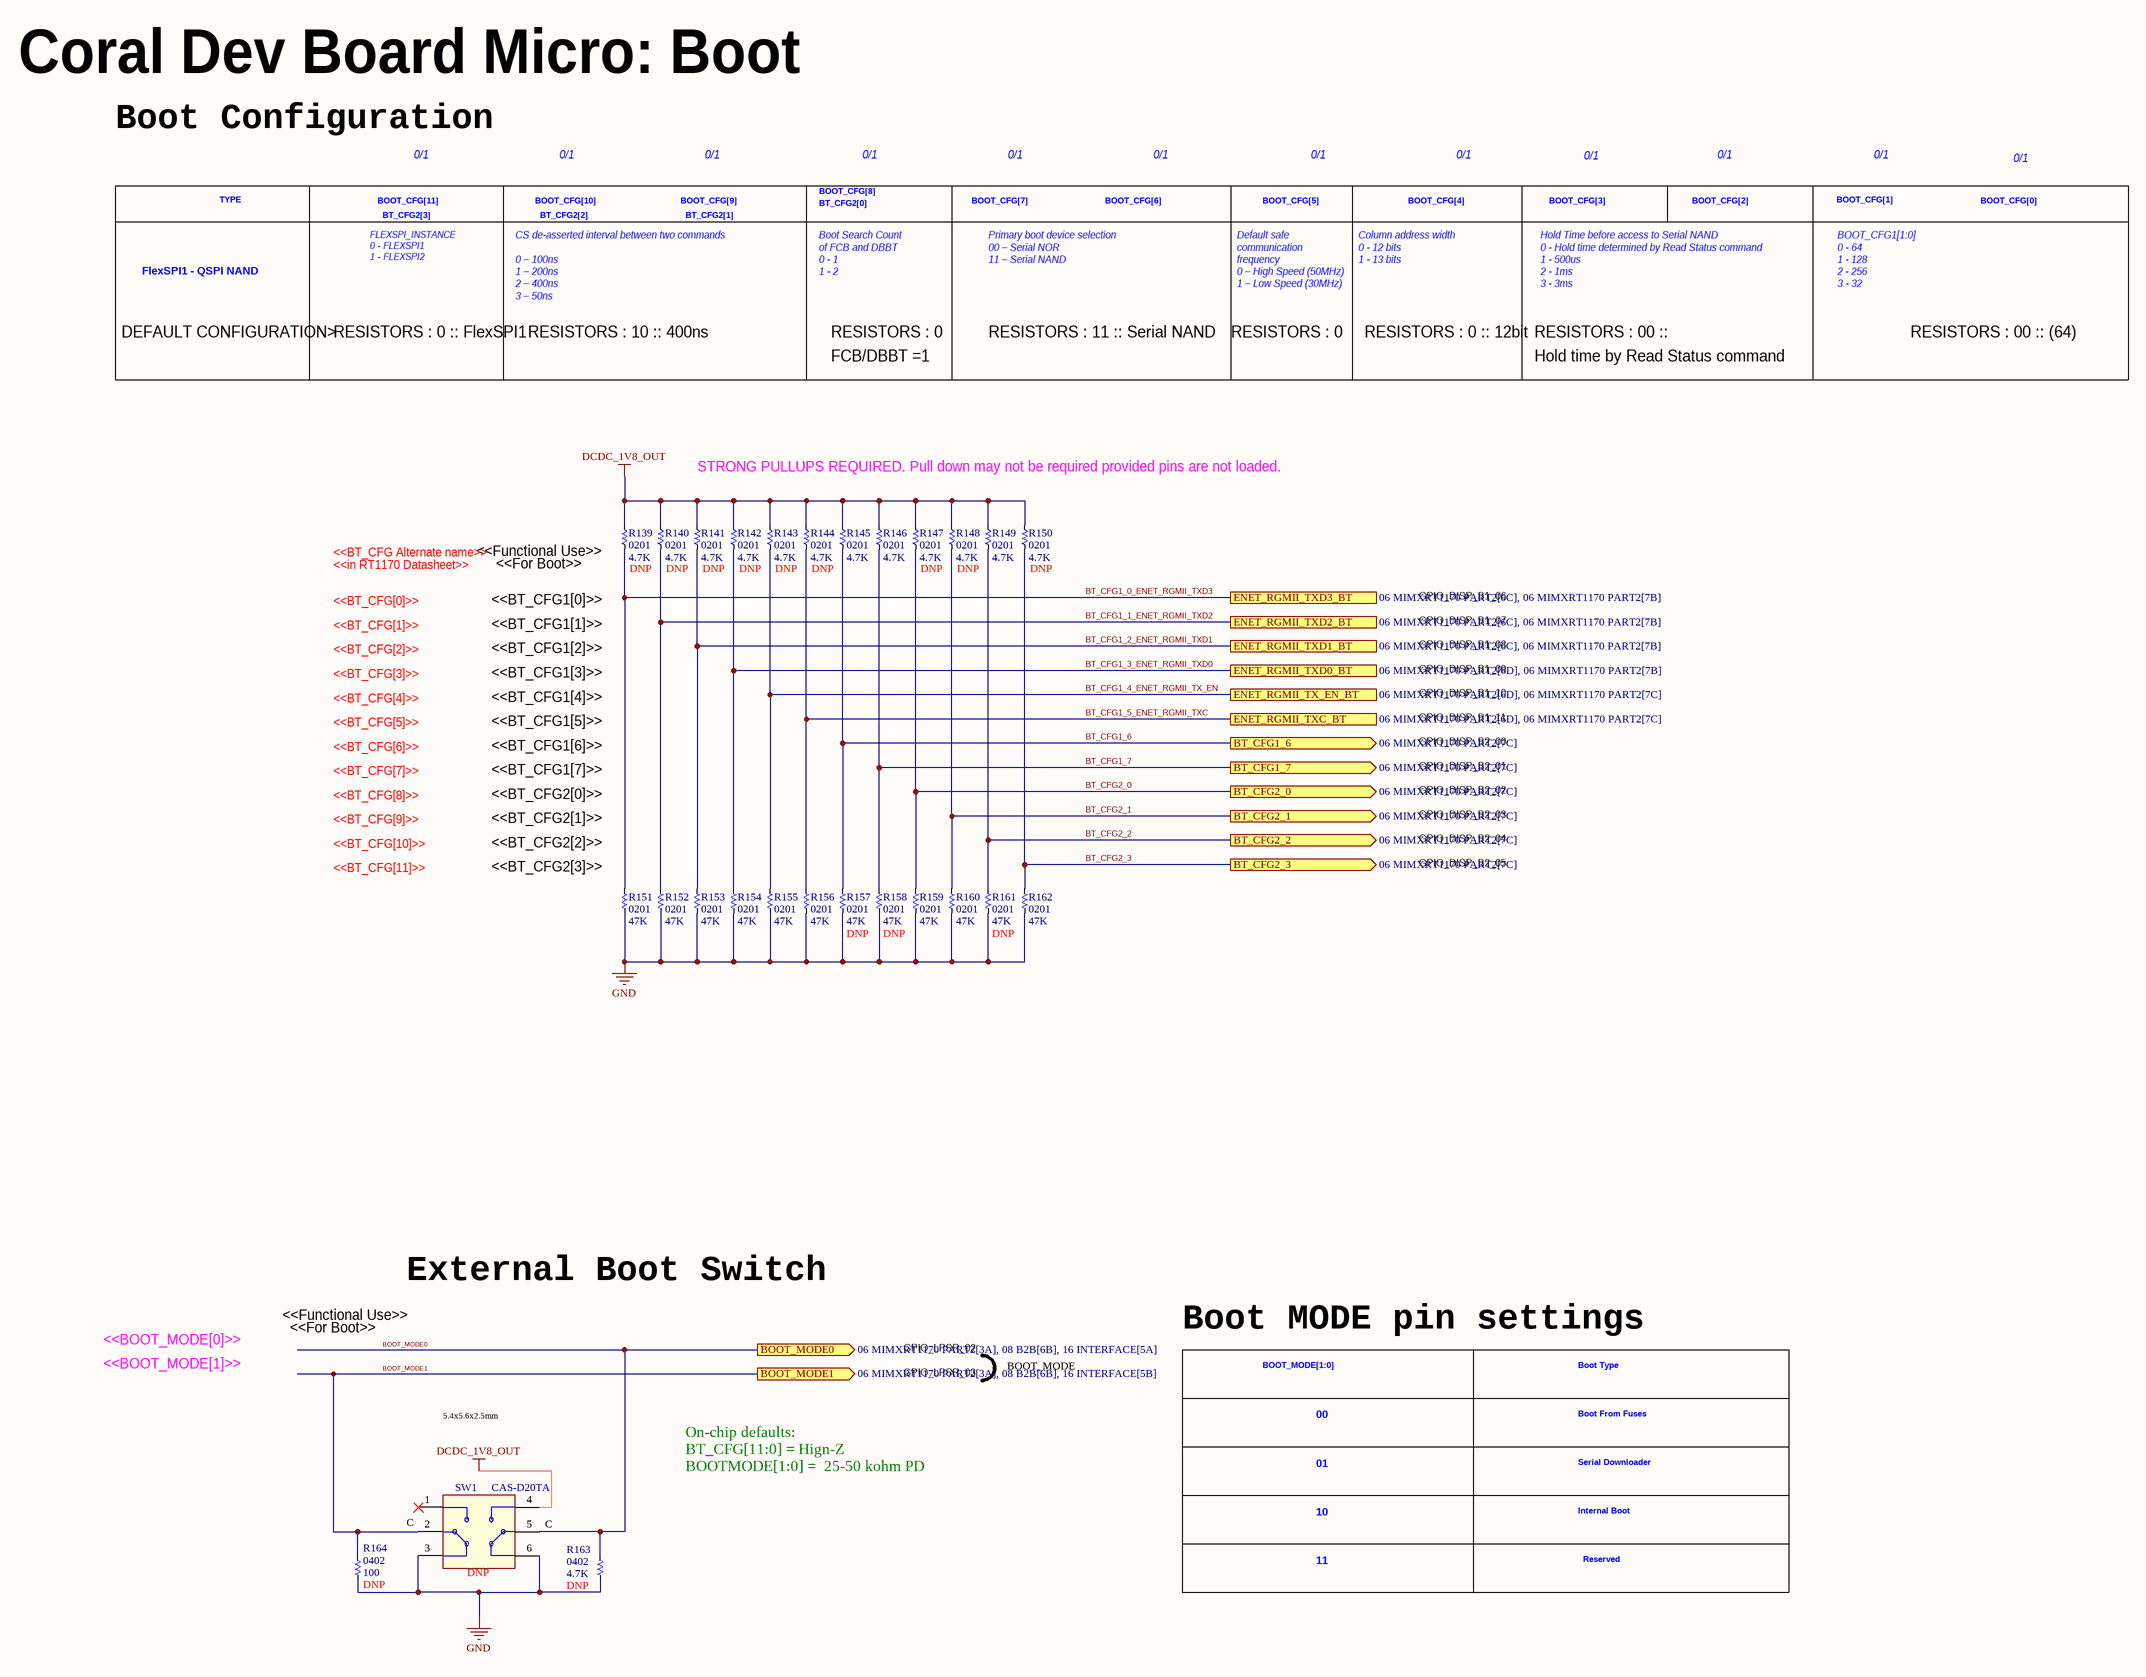
[diagram p21: 15 BOOT.SchDoc]

### Parts
R139  value 4.7K  Package: 0201  [R0201]
R140  value 4.7K  Package: 0201  [R0201]
R141  value 4.7K  Package: 0201  [R0201]
R142  value 4.7K  Package: 0201  [R0201]
R143  value 4.7K  Package: 0201  [R0201]
R144  value 4.7K  Package: 0201  [R0201]
R145  value 4.7K  Package: 0201  [R0201]
R146  value 4.7K  Package: 0201  [R0201]
R147  value 4.7K  Package: 0201  [R0201]
R148  value 4.7K  Package: 0201  [R0201]
R149  value 4.7K  Package: 0201  [R0201]
R150  value 4.7K  Package: 0201  [R0201]
R151  value 47K  Package: 0201  [R0201]
R152  value 47K  Package: 0201  [R0201]
R153  value 47K  Package: 0201  [R0201]
R154  value 47K  Package: 0201  [R0201]
R155  value 47K  Package: 0201  [R0201]
R156  value 47K  Package: 0201  [R0201]
R157  value 47K  Package: 0201  [R0201]
R158  value 47K  Package: 0201  [R0201]
R159  value 47K  Package: 0201  [R0201]
R160  value 47K  Package: 0201  [R0201]
R161  value 47K  Package: 0201  [R0201]
R162  value 47K  Package: 0201  [R0201]
R163  value 4.7K  Package: 0402  [R0402]
R164  value 100  Package: 0402  [R0402]
SW1  MFG P/N: CAS-D20TA  [SWITCH_CAS-D20TA]  (hidden comment: SWITCH_NIDEC_CAS-D20TA)

### Ports
BOOT_MODE0 (out, see 06 MIMXRT1170 PART2[3A], 08 B2B[6B], 16 INTERFACE[5A]), BOOT_MODE1 (out, see 06 MIMXRT1170 PART2[3A], 08 B2B[6B], 16 INTERFACE[5B]), BT_CFG1_6 (out, see 06 MIMXRT1170 PART2[7C]), BT_CFG1_7 (out, see 06 MIMXRT1170 PART2[7C]), BT_CFG2_0 (out, see 06 MIMXRT1170 PART2[7C]), BT_CFG2_1 (out, see 06 MIMXRT1170 PART2[7C]), BT_CFG2_2 (out, see 06 MIMXRT1170 PART2[7C]), BT_CFG2_3 (out, see 06 MIMXRT1170 PART2[7C]), ENET_RGMII_TX_EN_BT (see 06 MIMXRT1170 PART2[6D], 06 MIMXRT1170 PART2[7C]), ENET_RGMII_TXC_BT (see 06 MIMXRT1170 PART2[6D], 06 MIMXRT1170 PART2[7C]), ENET_RGMII_TXD0_BT (see 06 MIMXRT1170 PART2[6D], 06 MIMXRT1170 PART2[7B]), ENET_RGMII_TXD1_BT (see 06 MIMXRT1170 PART2[6C], 06 MIMXRT1170 PART2[7B]), ENET_RGMII_TXD2_BT (see 06 MIMXRT1170 PART2[6C], 06 MIMXRT1170 PART2[7B]), ENET_RGMII_TXD3_BT (see 06 MIMXRT1170 PART2[6C], 06 MIMXRT1170 PART2[7B])

### Nets
DCDC_1V8_OUT: R139.2 R140.2 R141.2 R142.2 R143.2 R144.2 R145.2 R146.2 R147.2 R148.2 R149.2 R150.2 SW1.4
GND: R151.2 R152.2 R153.2 R154.2 R155.2 R156.2 R157.2 R158.2 R159.2 R160.2 R161.2 R162.2 R163.1 R164.1 SW1.3 SW1.6
BOOT_MODE0: R163.2 SW1.5 ; port BOOT_MODE0
BOOT_MODE1: R164.2 SW1.2 ; port BOOT_MODE1
BT_CFG1_0_ENET_RGMII_TXD3: R139.1 R151.1 ; port ENET_RGMII_TXD3_BT
BT_CFG1_1_ENET_RGMII_TXD2: R140.1 R152.1 ; port ENET_RGMII_TXD2_BT
BT_CFG1_2_ENET_RGMII_TXD1: R141.1 R153.1 ; port ENET_RGMII_TXD1_BT
BT_CFG1_3_ENET_RGMII_TXD0: R142.1 R154.1 ; port ENET_RGMII_TXD0_BT
BT_CFG1_4_ENET_RGMII_TX_EN: R143.1 R155.1 ; port ENET_RGMII_TX_EN_BT
BT_CFG1_5_ENET_RGMII_TXC: R144.1 R156.1 ; port ENET_RGMII_TXC_BT
BT_CFG1_6: R145.1 R157.1 ; port BT_CFG1_6
BT_CFG1_7: R146.1 R158.1 ; port BT_CFG1_7
BT_CFG2_0: R147.1 R159.1 ; port BT_CFG2_0
BT_CFG2_1: R148.1 R160.1 ; port BT_CFG2_1
BT_CFG2_2: R149.1 R161.1 ; port BT_CFG2_2
BT_CFG2_3: R150.1 R162.1 ; port BT_CFG2_3

Not connected (* = marked no-connect by the designer): SW1 1*

### Notes on the sheet
- Coral Dev Board Micro: Boot
- Boot Configuration
- 0/1
- TYPE
- BOOT_CFG[11]
- BT_CFG2[3]
- BOOT_CFG[10]
- BT_CFG2[2]
- BOOT_CFG[9]
- BT_CFG2[1]
- BOOT_CFG[8]
- BT_CFG2[0]
- BOOT_CFG[7]
- BOOT_CFG[6]
- BOOT_CFG[5]
- BOOT_CFG[4]
- BOOT_CFG[3]
- BOOT_CFG[2]
- BOOT_CFG[1]
- BOOT_CFG[0]
- FlexSPI1 - QSPI NAND
- FLEXSPI_INSTANCE
  0 - FLEXSPI1
  1 - FLEXSPI2
- Boot Search Count
  of FCB and DBBT
  0 - 1
  1 - 2
- Primary boot device selection
  00 – Serial NOR
  11 – Serial NAND
- Column address width
  0 - 12 bits
  1 - 13 bits
- BOOT_CFG1[1:0]
  0 - 64
  1 - 128
  2 - 256
  3 - 32
- DEFAULT CONFIGURATION>
- RESISTORS : 0 :: FlexSPI1
- CS de-asserted interval between two commands
  0 – 100ns
  1 – 200ns
  2 – 400ns
  3 – 50ns
- RESISTORS : 10 :: 400ns
- RESISTORS : 0
- RESISTORS : 11 :: Serial NAND
- Default safe
  communication
  frequency
  0 – High Speed (50MHz)
  1 – Low Speed (30MHz)
- RESISTORS : 0 :: 12bit
- RESISTORS : 00 ::
- Hold Time before access to Serial NAND
  0 - Hold time determined by Read Status command
  1 - 500us
  2 - 1ms
  3 - 3ms
- RESISTORS : 00 :: (64)
- FCB/DBBT =1
- Hold time by Read Status command
- STRONG PULLUPS REQUIRED. Pull down may not be required provided pins are not loaded.
- <<BT_CFG Alternate name>>
- <<in RT1170 Datasheet>>
- (near R139) <<Functional Use>>
- (near R139) <<For Boot>>
- <<BT_CFG[0]>>
- <<BT_CFG[1]>>
- <<BT_CFG1[0]>>
- <<BT_CFG1[1]>>
- GPIO_DISP_B1_06
- GPIO_DISP_B1_07
- GPIO_DISP_B1_08
- <<BT_CFG[2]>>
- <<BT_CFG[3]>>
- <<BT_CFG[4]>>
- <<BT_CFG1[2]>>
- <<BT_CFG1[3]>>
- <<BT_CFG1[4]>>
- GPIO_DISP_B1_09
- GPIO_DISP_B1_10
- <<BT_CFG[5]>>
- <<BT_CFG[6]>>
- <<BT_CFG1[5]>>
- <<BT_CFG1[6]>>
- GPIO_DISP_B1_11
- GPIO_DISP_B2_00
- GPIO_DISP_B2_01
- <<BT_CFG[7]>>
- <<BT_CFG[8]>>
- <<BT_CFG[9]>>
- <<BT_CFG1[7]>>
- <<BT_CFG2[0]>>
- <<BT_CFG2[1]>>
- GPIO_DISP_B2_02
- GPIO_DISP_B2_03
- <<BT_CFG[10]>>
- <<BT_CFG[11]>>
- <<BT_CFG2[2]>>
- (near R151) <<BT_CFG2[3]>>
- GPIO_DISP_B2_04
- GPIO_DISP_B2_05
- External Boot Switch
- <<BOOT_MODE[0]>>
- <<BOOT_MODE[1]>>
- <<For Boot>>
- <<Functional Use>>
- GPIO_LPSR_02
- GPIO_LPSR_03
- BOOT_MODE
- Boot MODE pin settings
- BOOT_MODE[1:0]
- Boot Type
- 5.4x5.6x2.5mm
- 00
- Boot From Fuses
- On-chip defaults:
  BT_CFG[11:0] = Hign-Z
  BOOTMODE[1:0] =  25-50 kohm PD
- 01
- Serial Downloader
- 10
- Internal Boot
- 11
- Reserved
- Title
- Size:
- Date:
- File:
- A2
- Number:
- Time:
- Revision:
- Sheet
- of
- (in symbol 227) C

### Library data of the parts
R139-R150 = 6602: as R39 on sheet 14 TPU; Status: Released; Power: 1/20W; Tolerance: 5%; LOON: 470-00012-00; Gecko: 470-00012-00; XPN: 470-00012-00
  R139-R144 R147 R148 R150: DNP: DNP
R151-R162 = 6833: RES, 47K, 5%, 1/20W, 0201; ID: 6833; MFG: PANASONIC; MFG P/N: ERJ1GEJ473C; COMMON: 470-00003-00; Status: NRND; Power: 1/20W; Tolerance: 5%; LOON: 470-00003-00; Gecko: 470-00003-00; XPN: 470-00003-00
  R157 R158 R161: DNP: DNP
R163 = 3866: RES, 4.7K, 1%, 1/10W, 0402; ID: 3866; MFG: PANASONIC; MFG P/N: ERJ-2RKF4701X; COMMON: 470-01775-00; PROXY: Use ID #8133; KOI: 470-17107-00; Status: Released; Power: 1/10W; Tolerance: 1%; Height: 0.40mm; Supplier 1: Digi-Key; XPN: 470-01775-00; Supplier Part Number 1: P4.70KLCT-ND; DNP: DNP
R164 = 6318: RES, 100, 5%, 1/16W, 0402, AUTO GRADE; ID: 6318; MFG: VISHAY; MFG P/N: CRCW0402100RJNED; COMMON: 470-02903-00; Status: Released; Power: 1/16W; Tolerance: 5%; XPN: 470-02903-00; DNP: DNP
SW1 = 227: SW, SLIDE, SPDTx2, 100mA, 6VDC, 2-POS, ON-ON, GOLD, SMT; ID: 227; MFG: Nidec Copal Electronics; Voltage, Rated: 6V; Status: Released; Category: Slide Switches; RoHS Compliant: Yes; Supplier 1: Digi-Key; Height: 2.5mm; Mounting Type: SMD; HelpURL: https://www.digikey.com/en/products/detail/nidec-copal-electronics/CAS-D20TA/341665; ComponentLink1Description: Datasheet; ComponentLink1URL: https://drive.google.com/file/d/1yHSGEBNR3CK8ELRyOJmK0djXwn1fRk_2/view; Supplier Part Number 1: CASD20JTR-ND; Features: Tape Seal; Operating Temperature: -40°C ~ 85°C; DNP: DNP

## Sheet 16 INTERFACE.SchDoc: Luna v2
size A2; VersionControl_RevNumber: DNP; IsUserConfigurable: DNP; OrgAddr3: Sunrise FL 33323; OrgName: Pixels on Target; Page Create Date: March  8, 1995; Page Number: 5; Page Size: A2; Page Count: 14; OrgAddr2: Suite #104; RevCode: A; Doc: SCH30-00070-00; DsnPath: C:\Users\Carter Nichols\Documents\BitBucket boards (Cadence)\30-00070-00_Original\SCH30-00070-00.DSN; SchematicName: SC30-00070-00; PageName: 05-POWER IN; PageSize: A2; TopSchematic: True; Address4: United States
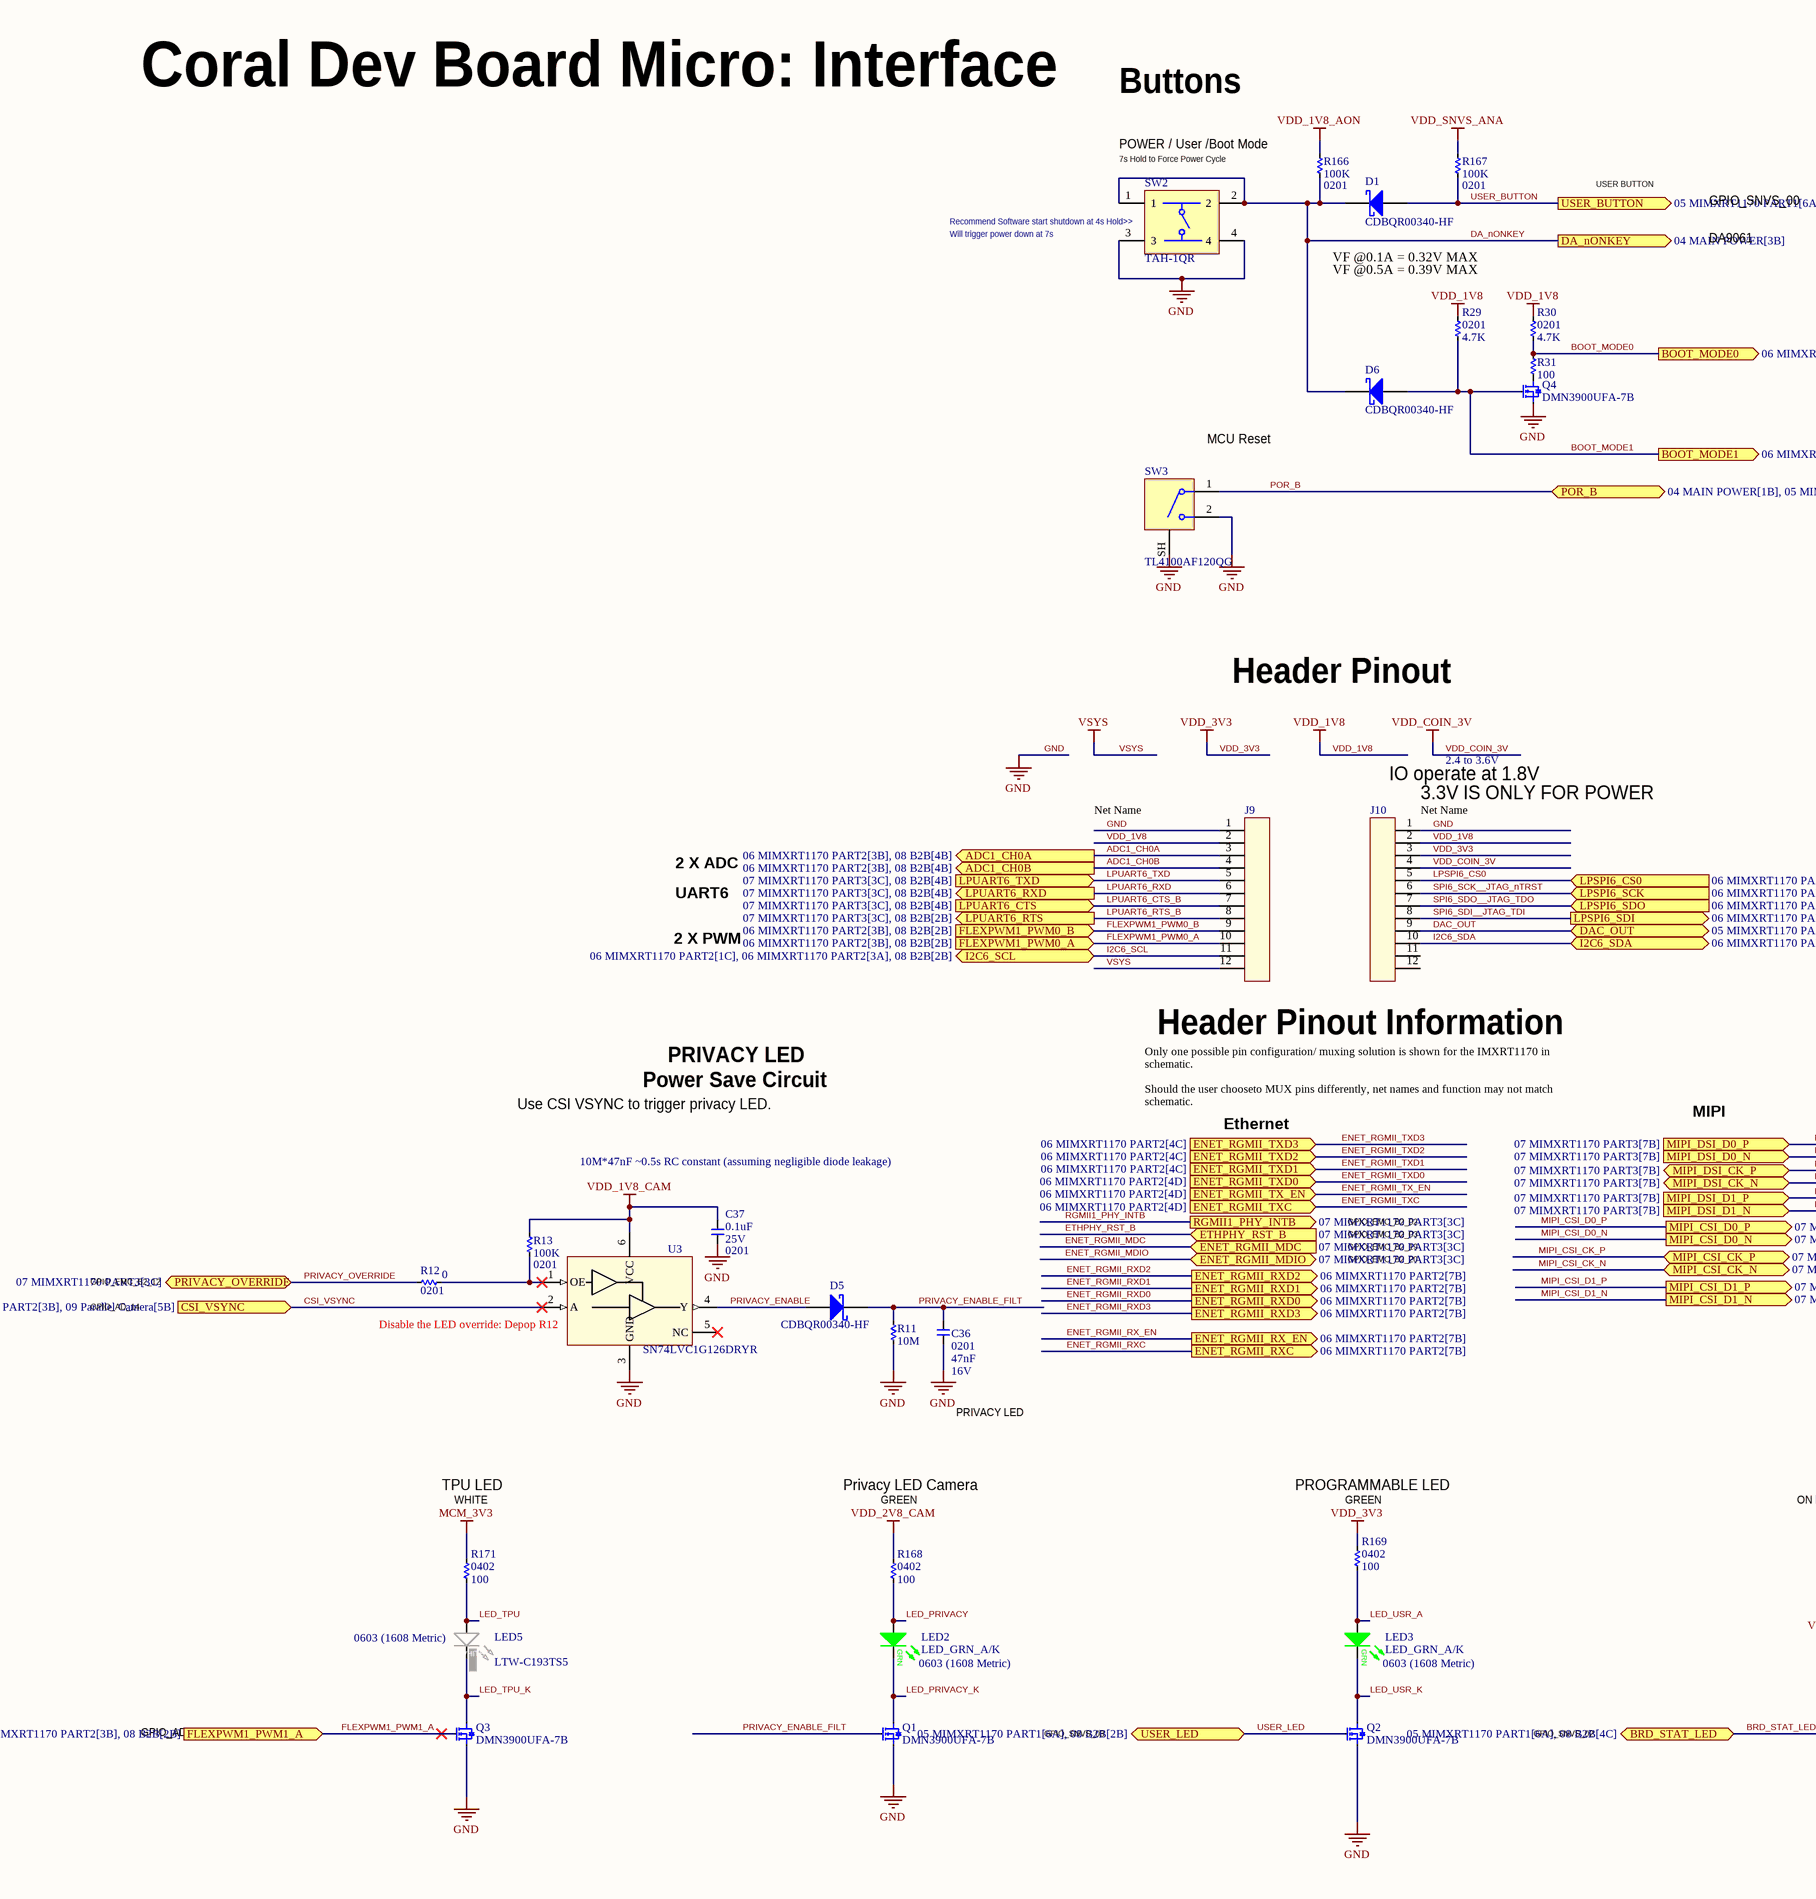
[diagram p22: 16 INTERFACE.SchDoc, left]
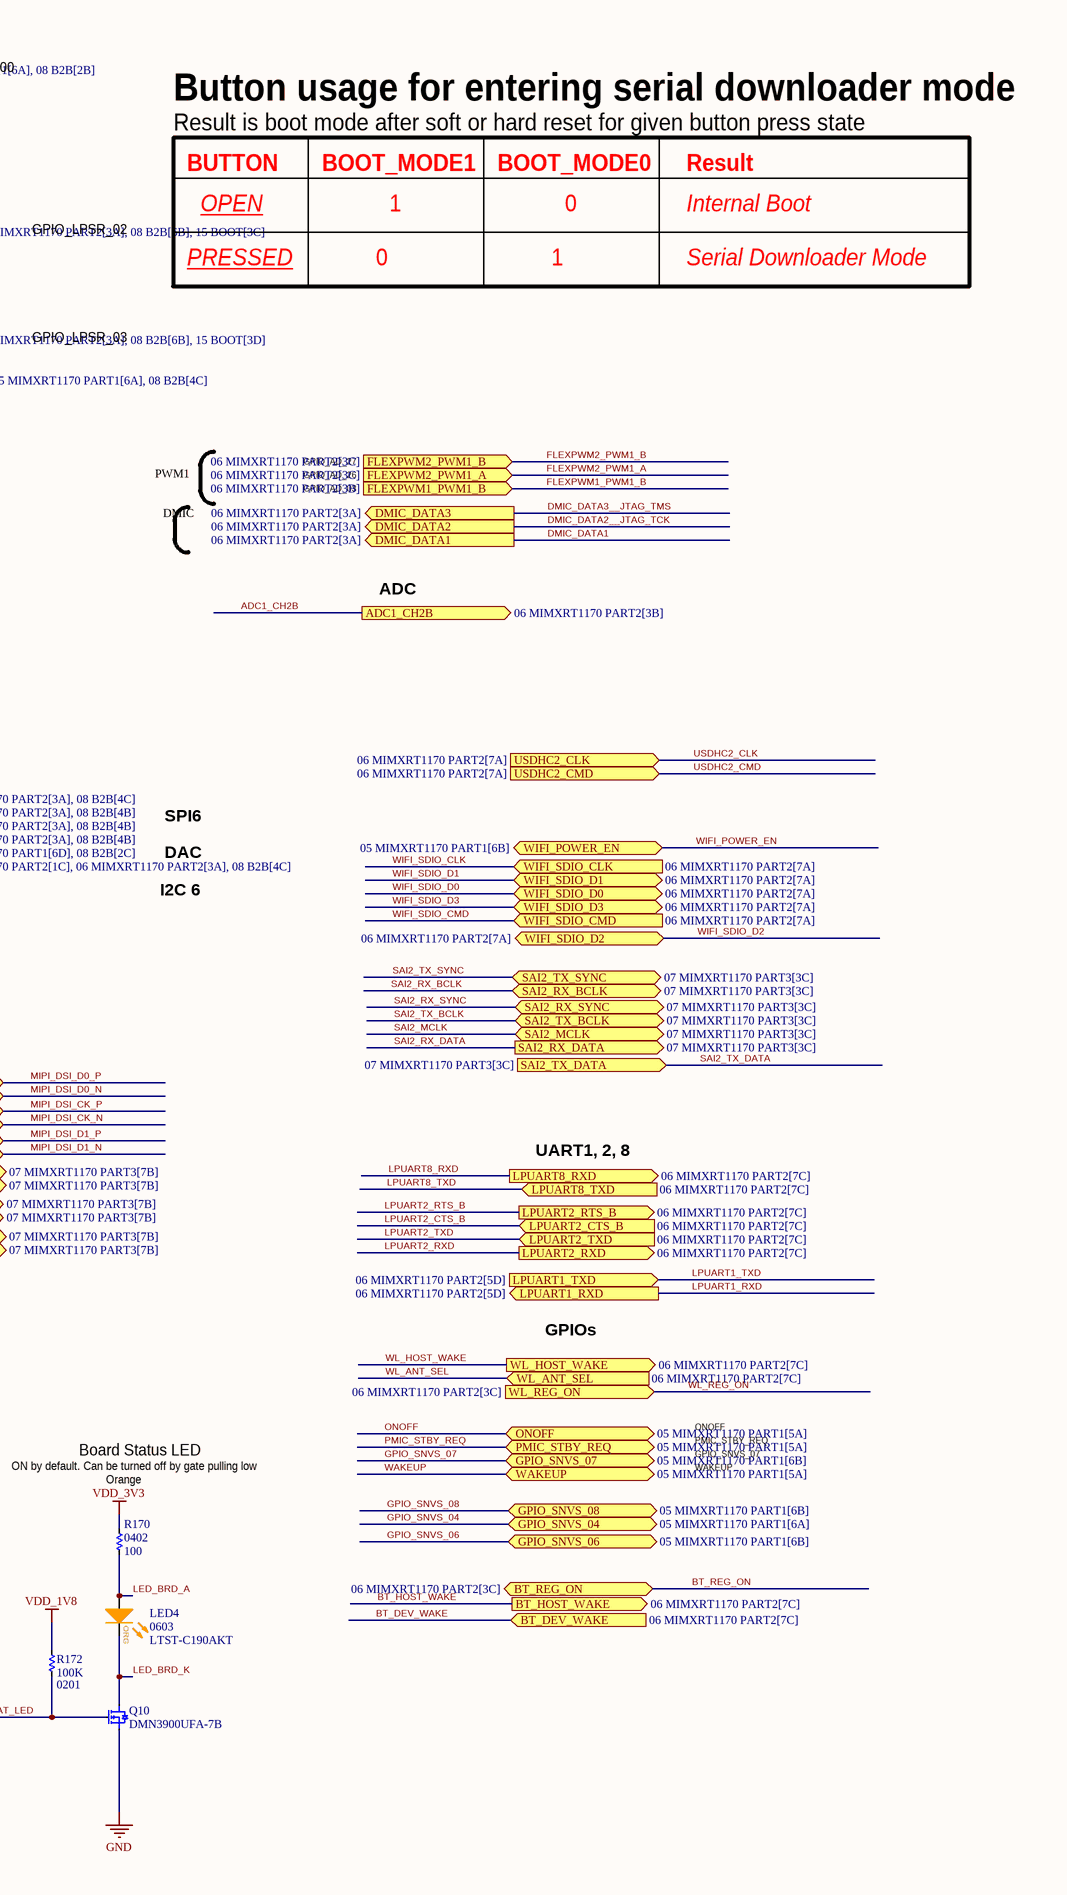
[diagram p23: 16 INTERFACE.SchDoc, right]

### Parts
C36  value 47nF  Package: 0201  Voltage: 16V  [C0201]  (hidden comment: __Template_Cap)
C37  value 0.1uF  Package: 0201  Voltage: 25V  [C0201Y]  (hidden comment: __Template_Cap)
D1  value CDBQR00340-HF  [D0402_H0.55MM]  (hidden comment: __Template_DIODE_SCHOTTKY)
D5  value CDBQR00340-HF  [D0402_H0.55MM]  (hidden comment: __Template_DIODE_SCHOTTKY)
D6  value CDBQR00340-HF  [D0402_H0.55MM]  (hidden comment: __Template_DIODE_SCHOTTKY)
J9  (no value)  [HEADER_1X12_POS_UNSHROUDED]
J10  (no value)  [HEADER_1X12_POS_UNSHROUDED]
LED2  LED_GRN_A/K  Package: 0603 (1608 Metric)  [LED_0603_0.67mm]
LED3  LED_GRN_A/K  Package: 0603 (1608 Metric)  [LED_0603_0.67mm]
LED4  value LTST-C190AKT  Package: 0603  [LED_0603P_ORANGE]  (hidden comment: __Template_LED_ORG)
LED5  value LTW-C193TS5  Package: 0603 (1608 Metric)  [LED_0603P_WHITE]  (hidden comment: __Template_LED_WHT)
Q1  MFG P/N: DMN3900UFA-7B  [3XDFN]  (hidden comment: NFET_DMN3900UFA)
Q2  MFG P/N: DMN3900UFA-7B  [3XDFN]  (hidden comment: NFET_DMN3900UFA)
Q3  MFG P/N: DMN3900UFA-7B  [3XDFN]  (hidden comment: NFET_DMN3900UFA)
Q4  MFG P/N: DMN3900UFA-7B  [3XDFN]  (hidden comment: NFET_DMN3900UFA)
Q10  MFG P/N: DMN3900UFA-7B  [3XDFN]  (hidden comment: NFET_DMN3900UFA)
R11  value 10M  [R0402]
R12  value 0  Package: 0201  [R0201]
R13  value 100K  Package: 0201  [R0201]
R29  value 4.7K  Package: 0201  [R0201]
R30  value 4.7K  Package: 0201  [R0201]
R31  value 100  [R0201]
R166  value 100K  Package: 0201  [R0201]
R167  value 100K  Package: 0201  [R0201]
R168  value 100  Package: 0402  [R0402]
R169  value 100  Package: 0402  [R0402]
R170  value 100  Package: 0402  [R0402]
R171  value 100  Package: 0402  [R0402]
R172  value 100K  Package: 0201  [R0201]
SW2  MFG P/N: TAH-1QR  [SWITCH_TAH1QR]  (hidden comment: SWITCH_TAH1QR)
SW3  MFG P/N: TL4100AF120QG  [SWITCH_TL4100AF120QG]  (hidden comment: SWITCH_E-SWITCH_TL4100AF120QG)
U3  MFG P/N: SN74LVC1G126DRYR  [SON50P145X100X60-6]  (hidden comment: BUF_SN74LVC1G126DRYR)

### Ports
ADC1_CH0A (out, see 06 MIMXRT1170 PART2[3B], 08 B2B[4B]), ADC1_CH0B (out, see 06 MIMXRT1170 PART2[3B], 08 B2B[4B]), ADC1_CH2B (out, see 06 MIMXRT1170 PART2[3B]), BOOT_MODE0 (out, see 06 MIMXRT1170 PART2[3A], 08 B2B[6B], 15 BOOT[3C]), BOOT_MODE1 (out, see 06 MIMXRT1170 PART2[3A], 08 B2B[6B], 15 BOOT[3D]), BRD_STAT_LED (bidir, see 05 MIMXRT1170 PART1[6A], 08 B2B[4C]), BT_DEV_WAKE (in, see 06 MIMXRT1170 PART2[7C]), BT_HOST_WAKE (out, see 06 MIMXRT1170 PART2[7C]), BT_REG_ON (bidir, see 06 MIMXRT1170 PART2[3C]), CSI_VSYNC (in, see 06 MIMXRT1170 PART2[3B], 09 Parallel Camera[5B]), DA_nONKEY (out, see 04 MAIN POWER[3B]), DAC_OUT (bidir, see 05 MIMXRT1170 PART1[6D], 08 B2B[2C]), DMIC_DATA1 (out, see 06 MIMXRT1170 PART2[3A]), DMIC_DATA2 (out, see 06 MIMXRT1170 PART2[3A]), DMIC_DATA3 (out, see 06 MIMXRT1170 PART2[3A]), ENET_RGMII_MDC (in, see 07 MIMXRT1170 PART3[3C]), ENET_RGMII_MDIO (bidir, see 07 MIMXRT1170 PART3[3C]), ENET_RGMII_RX_EN (out, see 06 MIMXRT1170 PART2[7B]), ENET_RGMII_RXC (out, see 06 MIMXRT1170 PART2[7B]), ENET_RGMII_RXD0 (out, see 06 MIMXRT1170 PART2[7B]), ENET_RGMII_RXD1 (out, see 06 MIMXRT1170 PART2[7B]), ENET_RGMII_RXD2 (out, see 06 MIMXRT1170 PART2[7B]), ENET_RGMII_RXD3 (out, see 06 MIMXRT1170 PART2[7B]), ENET_RGMII_TX_EN (in, see 06 MIMXRT1170 PART2[4D]), ENET_RGMII_TXC (in, see 06 MIMXRT1170 PART2[4D]), ENET_RGMII_TXD0 (in, see 06 MIMXRT1170 PART2[4D]), ENET_RGMII_TXD1 (in, see 06 MIMXRT1170 PART2[4C]), ENET_RGMII_TXD2 (in, see 06 MIMXRT1170 PART2[4C]), ENET_RGMII_TXD3 (in, see 06 MIMXRT1170 PART2[4C]), ETHPHY_RST_B (in, see 07 MIMXRT1170 PART3[3C]), FLEXPWM1_PWM0_A (in, see 06 MIMXRT1170 PART2[3B], 08 B2B[2B]), FLEXPWM1_PWM0_B (in, see 06 MIMXRT1170 PART2[3B], 08 B2B[2B]), FLEXPWM1_PWM1_A (in, see 06 MIMXRT1170 PART2[3B], 08 B2B[2B]), FLEXPWM1_PWM1_B (in, see 06 MIMXRT1170 PART2[3B]), FLEXPWM2_PWM1_A (in, see 06 MIMXRT1170 PART2[3C]), FLEXPWM2_PWM1_B (in, see 06 MIMXRT1170 PART2[3C]), GPIO_SNVS_04 (bidir, see 05 MIMXRT1170 PART1[6A]), GPIO_SNVS_06 (bidir, see 05 MIMXRT1170 PART1[6B]), GPIO_SNVS_07 (bidir, see 05 MIMXRT1170 PART1[6B]), GPIO_SNVS_08 (bidir, see 05 MIMXRT1170 PART1[6B]), I2C6_SCL (bidir, see 06 MIMXRT1170 PART2[1C], 06 MIMXRT1170 PART2[3A], 08 B2B[2B]), I2C6_SDA (bidir, see 06 MIMXRT1170 PART2[1C], 06 MIMXRT1170 PART2[3A], 08 B2B[4C]), LPSPI6_CS0 (in, see 06 MIMXRT1170 PART2[3A], 08 B2B[4C]), LPSPI6_SCK (in, see 06 MIMXRT1170 PART2[3A], 08 B2B[4B]), LPSPI6_SDI (out, see 06 MIMXRT1170 PART2[3A], 08 B2B[4B]), LPSPI6_SDO (in, see 06 MIMXRT1170 PART2[3A], 08 B2B[4B]), LPUART1_RXD (out, see 06 MIMXRT1170 PART2[5D]), LPUART1_TXD (in, see 06 MIMXRT1170 PART2[5D]), LPUART2_CTS_B (in, see 06 MIMXRT1170 PART2[7C]), LPUART2_RTS_B (out, see 06 MIMXRT1170 PART2[7C]), LPUART2_RXD (out, see 06 MIMXRT1170 PART2[7C]), LPUART2_TXD (in, see 06 MIMXRT1170 PART2[7C]), LPUART6_CTS (in, see 07 MIMXRT1170 PART3[3C], 08 B2B[4B]), LPUART6_RTS (out, see 07 MIMXRT1170 PART3[3C], 08 B2B[2B]), LPUART6_RXD (out, see 07 MIMXRT1170 PART3[3C], 08 B2B[4B]), LPUART6_TXD (in, see 07 MIMXRT1170 PART3[3C], 08 B2B[4B]), LPUART8_RXD (out, see 06 MIMXRT1170 PART2[7C]), LPUART8_TXD (in, see 06 MIMXRT1170 PART2[7C]), MIPI_CSI_CK_N (bidir, see 07 MIMXRT1170 PART3[7B]), MIPI_CSI_CK_P (bidir, see 07 MIMXRT1170 PART3[7B]), MIPI_CSI_D0_N (out, see 07 MIMXRT1170 PART3[7B]), MIPI_CSI_D0_P (out, see 07 MIMXRT1170 PART3[7B]), MIPI_CSI_D1_N (out, see 07 MIMXRT1170 PART3[7B]), MIPI_CSI_D1_P (out, see 07 MIMXRT1170 PART3[7B]), MIPI_DSI_CK_N (bidir, see 07 MIMXRT1170 PART3[7B]), MIPI_DSI_CK_P (bidir, see 07 MIMXRT1170 PART3[7B]), MIPI_DSI_D0_N (in, see 07 MIMXRT1170 PART3[7B]), MIPI_DSI_D0_P (in, see 07 MIMXRT1170 PART3[7B]), MIPI_DSI_D1_N (in, see 07 MIMXRT1170 PART3[7B]), MIPI_DSI_D1_P (in, see 07 MIMXRT1170 PART3[7B]), ONOFF (bidir, see 05 MIMXRT1170 PART1[5A]), PMIC_STBY_REQ (bidir, see 05 MIMXRT1170 PART1[5A]), POR_B (bidir, see 04 MAIN POWER[1B], 05 MIMXRT1170 PART1[6A], 08 B2B[4C]), PRIVACY_OVERRIDE (bidir, see 07 MIMXRT1170 PART3[3C]), RGMII1_PHY_INTB (out, see 07 MIMXRT1170 PART3[3C]), SAI2_MCLK (bidir, see 07 MIMXRT1170 PART3[3C]), SAI2_RX_BCLK (bidir, see 07 MIMXRT1170 PART3[3C]), SAI2_RX_DATA (out, see 07 MIMXRT1170 PART3[3C]), SAI2_RX_SYNC (bidir, see 07 MIMXRT1170 PART3[3C]), SAI2_TX_BCLK (bidir, see 07 MIMXRT1170 PART3[3C]), SAI2_TX_DATA (in, see 07 MIMXRT1170 PART3[3C]), SAI2_TX_SYNC (bidir, see 07 MIMXRT1170 PART3[3C]), USDHC2_CLK (in, see 06 MIMXRT1170 PART2[7A]), USDHC2_CMD (in, see 06 MIMXRT1170 PART2[7A]), USER_BUTTON (out, see 05 MIMXRT1170 PART1[6A], 08 B2B[2B]), USER_LED (bidir, see 05 MIMXRT1170 PART1[6A], 08 B2B[2B]), WAKEUP (bidir, see 05 MIMXRT1170 PART1[5A]), WIFI_POWER_EN (bidir, see 05 MIMXRT1170 PART1[6B]), WIFI_SDIO_CLK (in, see 06 MIMXRT1170 PART2[7A]), WIFI_SDIO_CMD (in, see 06 MIMXRT1170 PART2[7A]), WIFI_SDIO_D0 (bidir, see 06 MIMXRT1170 PART2[7A]), WIFI_SDIO_D1 (bidir, see 06 MIMXRT1170 PART2[7A]), WIFI_SDIO_D2 (bidir, see 06 MIMXRT1170 PART2[7A]), WIFI_SDIO_D3 (bidir, see 06 MIMXRT1170 PART2[7A]), WL_ANT_SEL (in, see 06 MIMXRT1170 PART2[7C]), WL_HOST_WAKE (out, see 06 MIMXRT1170 PART2[7C]), WL_REG_ON (in, see 06 MIMXRT1170 PART2[3C])

### Nets
GND: C36.2 C37.2 J9.1 J10.1 Q1.2(S) Q2.2(S) Q3.2(S) Q4.2(S) Q10.2(S) R11.1 SW2.3 SW2.4 SW3.2 SW3.SH U3.3(GND)
MCM_3V3: R171.2
VDD_1V8: J9.2 J10.2 R29.2 R30.2 R172.2
VDD_1V8_AON: R166.2
VDD_1V8_CAM: C37.1 R13.2 U3.6(VCC)
VDD_2V8_CAM: R168.2
VDD_3V3: J10.3 R169.2 R170.2
VDD_COIN_3V: J10.4
VDD_SNVS_ANA: R167.2
VSYS: J9.12
ADC1_CH0A: J9.3 ; port ADC1_CH0A
ADC1_CH0B: J9.4 ; port ADC1_CH0B
BOOT_MODE0: R30.1 R31.2 ; port BOOT_MODE0
BOOT_MODE1: D6.A Q4.1(G) R29.1 ; port BOOT_MODE1
BRD_STAT_LED: Q10.1(G) R172.1 ; port BRD_STAT_LED
CSI_VSYNC: U3.2(A) ; port CSI_VSYNC
DA_nONKEY: D1.K D6.K R166.1 SW2.1 SW2.2 ; port DA_nONKEY
DAC_OUT: J10.9 ; port DAC_OUT
FLEXPWM1_PWM0_A: J9.10 ; port FLEXPWM1_PWM0_A
FLEXPWM1_PWM0_B: J9.9 ; port FLEXPWM1_PWM0_B
FLEXPWM1_PWM1_A: Q3.1(G) ; port FLEXPWM1_PWM1_A
I2C6_SCL: J9.11 ; port I2C6_SCL
I2C6_SDA: J10.10 ; port I2C6_SDA
LED_BRD_A: LED4.2(A) R170.1
LED_BRD_K: LED4.1(K) Q10.3(D)
LED_PRIVACY: LED2.A R168.1
LED_PRIVACY_K: LED2.K Q1.3(D)
LED_TPU: LED5.2(A) R171.1
LED_TPU_K: LED5.1(K) Q3.3(D)
LED_USR_A: LED3.A R169.1
LED_USR_K: LED3.K Q2.3(D)
LPSPI6_CS0: J10.5 ; port LPSPI6_CS0
LPUART6_CTS_B: J9.7 ; port LPUART6_CTS
LPUART6_RTS_B: J9.8 ; port LPUART6_RTS
LPUART6_RXD: J9.6 ; port LPUART6_RXD
LPUART6_TXD: J9.5 ; port LPUART6_TXD
POR_B: SW3.1 ; port POR_B
PRIVACY_ENABLE: D5.A U3.4(Y)
PRIVACY_ENABLE_FILT: C36.1 D5.K Q1.1(G) R11.2
PRIVACY_OVERRIDE: R12.2 ; port PRIVACY_OVERRIDE
SPI6_SCK__JTAG_nTRST: J10.6 ; port LPSPI6_SCK
SPI6_SDI__JTAG_TDI: J10.8 ; port LPSPI6_SDI
SPI6_SDO__JTAG_TDO: J10.7 ; port LPSPI6_SDO
USER_BUTTON: D1.A R167.1 ; port USER_BUTTON
USER_LED: Q2.1(G) ; port USER_LED
NetQ4_3: Q4.3(D) R31.1
NetR12_1: R12.1 R13.1 U3.1(OE)

Not connected (* = marked no-connect by the designer): J10 11 12; U3 5(NC)*

### Notes on the sheet
- Coral Dev Board Micro: Interface
- Buttons
- POWER / User /Boot Mode
- (near SW2) 7s Hold to Force Power Cycle
- (near SW2) Recommend Software start shutdown at 4s Hold>>
- Will trigger power down at 7s
- USER BUTTON
- GPIO_SNVS_00
- Button usage for entering serial downloader mode
- VF @0.1A = 0.32V MAX
- VF @0.5A = 0.39V MAX
- DA9061
- Result is boot mode after soft or hard reset for given button press state
- BUTTON
- BOOT_MODE1
- BOOT_MODE0
- Result
- GPIO_LPSR_02
- OPEN
- 1
- 0
- Internal Boot
- PRESSED
- Serial Downloader Mode
- (near SW3) MCU Reset
- GPIO_LPSR_03
- PWM1
- DMIC
- GPIO_AD_03
- GPIO_AD_26
- GPIO_AD_27
- Header Pinout
- ADC
- IO operate at 1.8V
- 3.3V IS ONLY FOR POWER
- 2.4 to 3.6V
- 2 X ADC
- Net Name
- (near J10) Net Name
- UART6
- DAC
- SPI6
- 2 X PWM
- I2C 6
- Header Pinout Information
- Power Save Circuit
- PRIVACY LED
- Only one possible pin configuration/ muxing solution is shown for the IMXRT1170 in schematic.
  Should the user chooseto MUX pins differently, net names and function may not match schematic.
- MIPI
- Use CSI VSYNC to trigger privacy LED.
  Discharge RC time constant approximately 500ms. Likely to be shorter due to leakage paths.
- 10M*47nF ~0.5s RC constant (assuming negligible diode leakage)
- Ethernet
- GPIO_EMC_B2_02
- GPIO_EMC_B2_03
- UART1, 2, 8
- GPIO_EMC_B2_12
- GPIO_AD_14
- GPIO_EMC_B2_19
- GPIO_EMC_B2_20
- (near U3) Disable the LED override: Depop R12
- GPIOs
- TPU LED
- Privacy LED Camera
- PROGRAMMABLE LED
- Board Status LED
- GPIO_SNVS_07
- PMIC_STBY_REQ
- ONOFF
- WHITE
- GREEN
- (near R169) GREEN
- ON by default. Can be turned off by gate pulling low
- (near R170) Orange
- WAKEUP
- GPIO_AD_02
- GPIO_SNVS_03
- GPIO_SNVS_02
- Title
- Size:
- Date:
- File:
- A2
- Number:
- Time:
- Revision:
- Sheet
- of
- (in symbol 61) ORG
- (in symbol 197) GRN

### Library data of the parts
C36 = 799: CAP, CER, X6S, 0.047uF, 16V, 10%, 0201, 0.33mm T; ID: 799; MFG: TDK; MFG P/N: C0603X6S1C473K030BC; XPN: 150-00153-00; Status: NRND; Dielectric: X6S; Tolerance: 10%; Height: 0.33mm T; ComponentLink1Description: Datasheet; COMMON: 150-00153-00
C37 = 386: as C83 on sheet 12 DMIC; Status: Released; Dielectric: X5R; Tolerance: 20%; Height: 0.33mm T; ComponentLink1Description: Datasheet; COMMON: 150-01204-00; LOON: 150-01204-00; Gecko: 150-01204-00
D1 D5 D6 = 353: DIODE, SCHOTTKY, 40V VRRM, 30mA IO, 500mA SURGE, 0402; ID: 353; MFG: Comchip Technology; Voltage – Forward (VF) (MAX) @ IF: 370 mV @ 1 mA; Current - Reverse Leakage @ VR: 1 µA @ 40 V; Status: Released; MFG P/N: CDBQR00340-HF; Package: 0402; Category: DIODE; RoHS Compliant: Yes; Diode Type: Schottky; Mounting Type: SMD; Voltage - DC Reverse (VR) (MAX): 40V; Current - Average Rectified (IO): 30mA; Operating Temperature – Junction: 125°C (Max); Supplier 1: Digi-Key; HelpURL: https://www.digikey.com/en/products/detail/comchip-technology/CDBQR00340-HF/3308478?s=N4IgTCBcDaIMIBEBCBFASgBgwZgCwYFoAJAMRAF0BfIA; ComponentLink1Description: Datasheet; ComponentLink1URL: https://www.comchiptech.com/admin/files/product/QW-G1106%20CDBQR00340-HF%20RevB.pdf; Height: 0.55mm; Supplier Part Number 1: 641-1978-2-ND
J9 J10 = 366: CONN, HDR, TH, STR, 1X12, 2.54mmP; ID: 366; MFG: SULLINS; MFG P/N: PBC12SAAN; COMMON: 210-00118-00; Status: Released; RoHS Compliant: Yes; LOON: 210-00118-00; XPN: 210-00118-00; Gecko: 210-00118-00
LED2 LED3 = 197: LED, GREEN, 570nm, 25mA, DIFFUSED, 0603; ID: 197; MFG: OSRAM Opto Semiconductors Inc.; MFG P/N: LG L29K-G2J1-24-Z; Value: LG L29K-G2J1-24-Z; Voltage – Forward (VF) (MAX) @ IF: 1.7V; COMMON: 370-00021-00; PROXY: 370-00433-00; Status: In Development; Category: LED; RoHS Compliant: Yes; Diode Type: LED; Mounting Type: SMD; Supplier 1: Digi-Key; HelpURL: https://www.digikey.in/product-detail/en/osram-opto-semiconductors-inc/LG-L29K-G2J1-24-Z/475-2709-1-ND/1938876; ComponentLink1Description: Datasheet; ComponentLink1URL: https://dammedia.osram.info/media/resource/hires/osram-dam-2493945/LG%20L29K.pdf; LOON: 370-00021-00; Color / Wavelength: GREEN; Supplier Part Number 1: 475-2709-1-ND
LED4 = 61: LED, ORANGE, 610NM, WATER CLEAR, GAP, 0603; ID: 61; MFG: Lite-On Technology Corp; Current - Average Rectified (IO): 10mA; Voltage – Forward (VF) (MAX) @ IF: 2.1V; PROXY: 246-00083-00; XPN: XS-10006042; Gecko: 370-00585-00; Orbital: 370-00646-00; Status: Released; MFG P/N: LTST-C190AKT; Category: Diode; Diode Type: LED; Mounting Type: SM; Operating Temperature – Junction: -40°C ~ 85°C; Supplier 1: Digi-Key; HelpURL: http://media.digikey.com/pdf/Data%20Sheets/Lite-On%20PDFs/LTST-C190AKT.pdf; ComponentLink1Description: Datasheet; ComponentLink1URL: http://media.digikey.com/pdf/Data%20Sheets/Lite-On%20PDFs/LTST-C190AKT.pdf; Color / Wavelength: ORANGE; Supplier Part Number 1: 160-1180-1-ND
LED5 = 69: LED, WHITE, 0603, SMD; ID: 69; MFG: Lite-On Technology Corp; Current - Average Rectified (IO): 5mA; Voltage – Forward (VF) (MAX) @ IF: 2.93V; COMMON: 246-00092-00; KOI: 370-00551-00; XPN: XS-10006051; Status: Released; MFG P/N: LTW-C193TS5; Category: Diode; Diode Type: LED; Mounting Type: SM; Operating Temperature – Junction: -20°C ~ +80°C; Supplier 1: Digi-Key; HelpURL: http://optoelectronics.liteon.com/upload/download/DS22-2004-203/S_110_LTW-C193TS5.pdf; ComponentLink1Description: Datasheet; ComponentLink1URL: http://optoelectronics.liteon.com/upload/download/DS22-2004-203/S_110_LTW-C193TS5.pdf; LOON: 246-00092-00; Gecko: 246-00092-00; Color / Wavelength: WHITE; Supplier Part Number 1: 160-1721-1-ND
Q1-Q4 Q10 = 24: MOSFET, N-CH, 30V, 0.55A, DMN3900; ID: 24; MFG: Diodes Incorporated; FET Type: MOSFET N-Channel, Metal Oxide; FET Feature: Logic Level Gate; Current - Continuios Drain (ID) @ 25° C: 550mA; RDS On (Max) @ ID, VGS: 760 mOhm @ 200mA, 4.5V; VGS(TH) (Max) @ ID: 950mV @ 250µA; Gate Charge (QG) @ VGS: 0.7nC @ 4.5V; Input Capacitance (CISS) @ VDS: 42.2pF @ 25V; Power - Max: 390mW; COMMON: 480-00750-00; XPN: XS-10020699; EES: 480-01751-00; Status: Released; Package: 3-XFDFN; Category: Discrete Semiconductor Products; RoHS Compliant: Yes; HelpURL: http://www.diodes.com/datasheets/DMN3900UFA.pdf; ComponentLink1Description: Datasheet; ComponentLink1URL: http://www.diodes.com/datasheets/DMN3900UFA.pdf; Voltage - Drain To Source (VDSS): 30V; Mounting Type: SM; Supplier 1: Digi-Key; Supplier Part Number 1: DMN3900UFA-7BCT-ND
R11 = 6216: Resistor, 10.0M Ohms, 0402, 0.063W, ±1%; ID: 6216; MFG: YAGEO; MFG P/N: RC0402FR-0710ML; Power: 1/16W; COMMON: 470-09411-00; XPN: XS-10019877; Status: Released; Package: 0402; Tolerance: 1%; Height: 0.40mm; Supplier 1: Digi-Key; Supplier Part Number 1: 311-10.0MLRCT-ND
R12 = 8315: as R86 on sheet 12 DMIC; Status: Released; Power: 1/20W; LOON: 470-00013-00; Gecko: 470-00013-00; XPN: 470-00013-00
R13 R166 R167 R172 = 7818: as R17 on sheet 13 USB; Status: NRND; Power: 1/20W; Tolerance: 1%; LOON: 470-00506-00; Gecko: 470-00506-00; XPN: 470-00506-00
R29 R30 = 6602: as R39 on sheet 14 TPU; Status: Released; Power: 1/20W; Tolerance: 5%; LOON: 470-00012-00; Gecko: 470-00012-00; XPN: 470-00012-00
R31 = 6785: RES, 100, 5%, 1/20W, 0201; ID: 6785; MFG: YAGEO; MFG P/N: RC0201JR-07100RL; COMMON: 470-00473-00; Status: Released; Package: 0201; Power: 1/20W; Tolerance: 5%; XPN: 470-00473-00
R168-R171 = 6318: as R164 on sheet 15 BOOT; Status: Released; Power: 1/16W; Tolerance: 5%; XPN: 470-02903-00
SW2 = 205: SW, TACT, SPST, 0.05A, 16VDC, OVAL ACTUATOR, SMD; ID: 205; MFG: Diptronics; Status: Released; Category: TACTILE SWITCH; RoHS Compliant: Yes; Supplier 1: Mouser; Height: 2.7mm; Mounting Type: SMD; HelpURL: https://www.mouser.com/ProductDetail/Diptronics/TAH-1QR?qs=%2Fha2pyFaduipOSvjgYeYPSjN0bL8fZLbb5mXZs85d5Y%3D; ComponentLink1Description: Datasheet; ComponentLink1URL: https://drive.google.com/file/d/13CKM1hC869BRhfaIa7pbNI_rAmBVZshp/view; Supplier Part Number 1: 113-TAH-1QR; Operating Temperature: -30°C ~ 85°C; Voltage, Rated: 16 VDC
SW3 = 224: SW, TACT, SPST-NO, OFF-MOM, 0.05A, 12VDC, RA, EDGE MOUNT; ID: 224; Status: Released; MFG: E-Switch; Category: Tactile Switches; RoHS Compliant: Yes; Supplier 1: Digi-Key; Height: 1.35mm; Mounting Type: SMD; HelpURL: https://www.digikey.com/en/products/detail/e-switch/TL4100AF120QG/2685028?s=N4IgTCBcDaICoBkAsBGADGgggMRWNAigOIgC6AvkA; ComponentLink1Description: Datasheet; ComponentLink1URL: http://spec_sheets.e-switch.com/specs/P004000.pdf; Supplier Part Number 1: EG4963TR-ND; Operating Temperature: -40°C ~ 85°C
U3 = 438: IC, BUFFER, 74LVC1G126, NON-INVERT, SINGLE ELEMENT, 3-STATE O/P, 32mA, 1.65V TO 5.5V VIN, UFDFN-6; ID: 438; MFG: Texas Instruments; Status: Released; Package: 6-SON (1.45x1); Category: Integrated Circuits (ICs); RoHS Compliant: Yes; Supplier 1: Digi-Key; ComponentLink1Description: Datasheet; ComponentLink1URL: https://www.ti.com/lit/ds/symlink/sn74lvc1g126.pdf?HQS=dis-dk-null-digikeymode-dsf-pf-null-wwe&ts=1622160361458; Mounting Type: SMD; Height: 0.6mm; Supplier Part Number 1: 296-SN74LVC1G126DRYRTR-ND; HelpURL: https://www.digikey.com/en/products/detail/texas-instruments/SN74LVC1G126DRYR/1591998?s=N4IgTCBcDaIMoDkDsAWAMgNQMIEYDiOYAbACIBKAmmSALoC%2BQA

## Sheet 17 Revision History.SchDoc: Luna v2
size A2; VersionControl_RevNumber: DNP; IsUserConfigurable: DNP; OrgAddr3: Sunrise FL 33323; OrgName: Pixels on Target; Page Create Date: March  8, 1995; Page Number: 5; Page Size: A2; Page Count: 14; OrgAddr2: Suite #104; RevCode: A; Doc: SCH30-00070-00; DsnPath: C:\Users\Carter Nichols\Documents\BitBucket boards (Cadence)\30-00070-00_Original\SCH30-00070-00.DSN; SchematicName: SC30-00070-00; PageName: 05-POWER IN; PageSize: A2; TopSchematic: True; Address4: United States
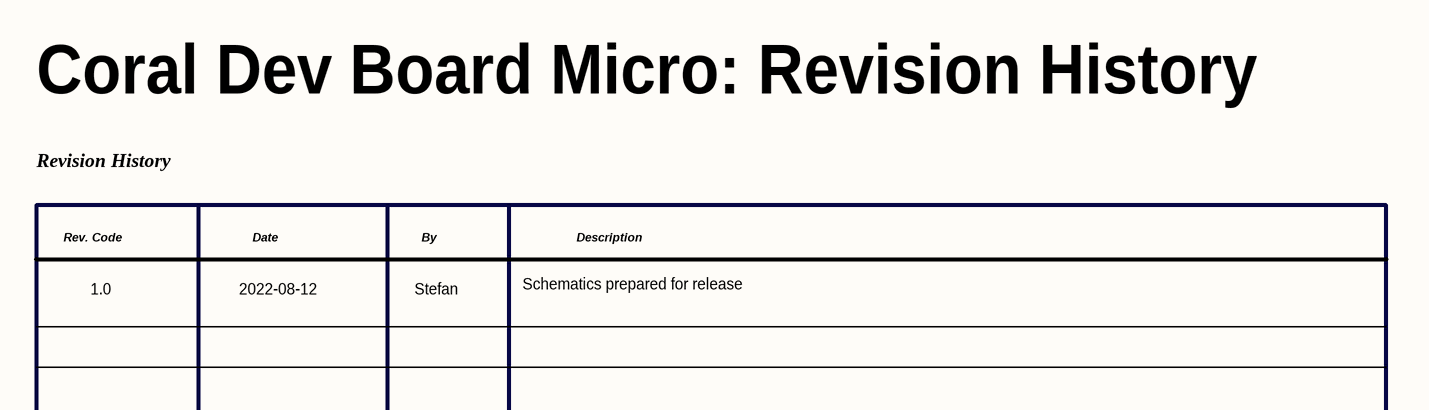
[diagram p24: 17 Revision History.SchDoc, left]
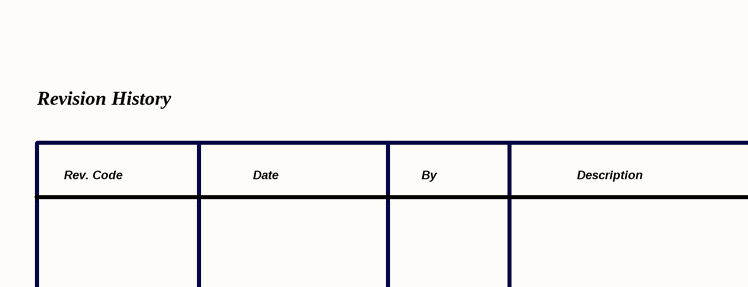
[diagram p25: 17 Revision History.SchDoc, right]

### Notes on the sheet
- Coral Dev Board Micro: Revision History
- Revision History
- Rev. Code
- Date
- By
- Description
- 1.0
- 2022-08-12
- Stefan
- Schematics prepared for release
- Title
- Size:
- Date:
- File:
- A2
- Number:
- Time:
- Revision:
- Sheet
- of